# EAGLE design InkTime_Schematic (EAGLE 9.7.0)
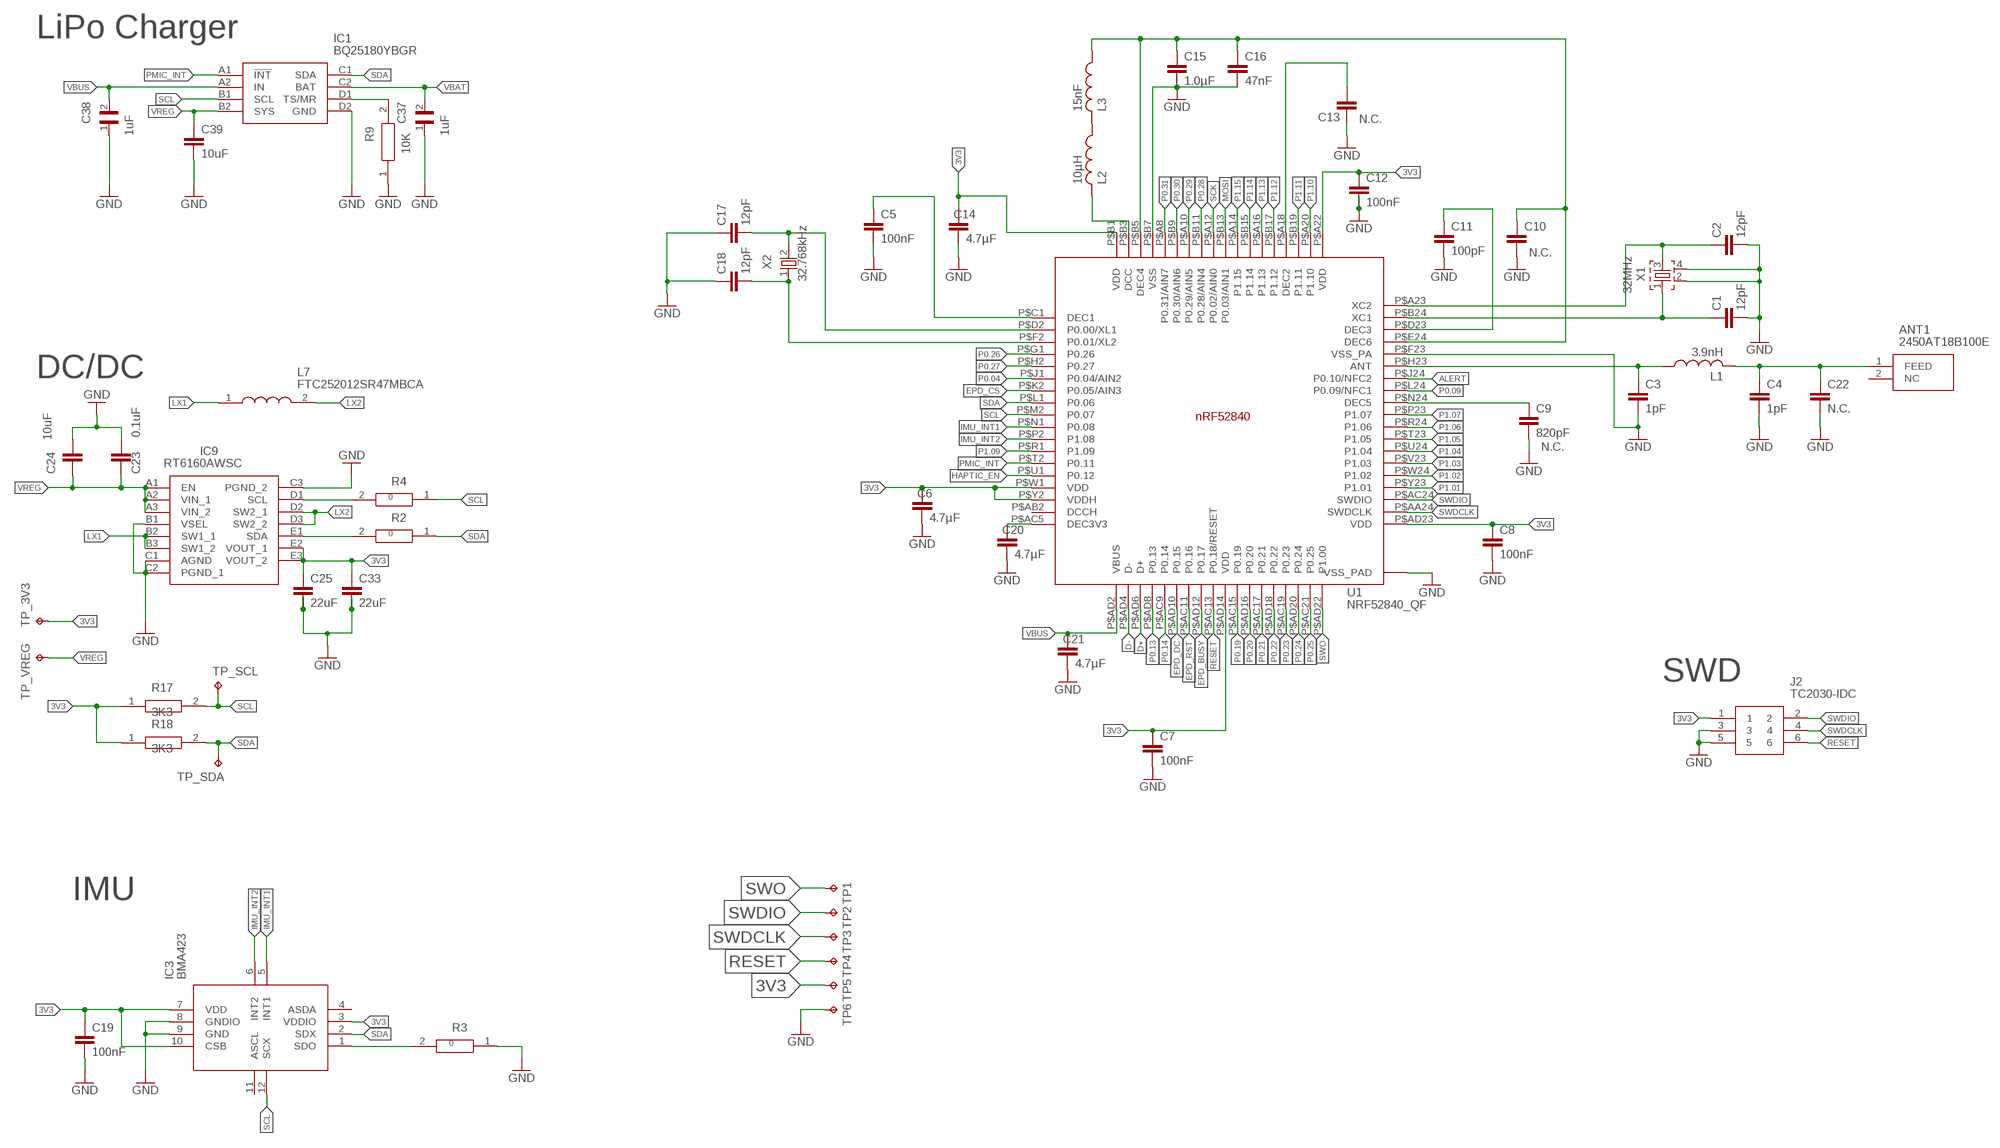
[diagram p0: schematic, sheet 1, part 1 of 2]
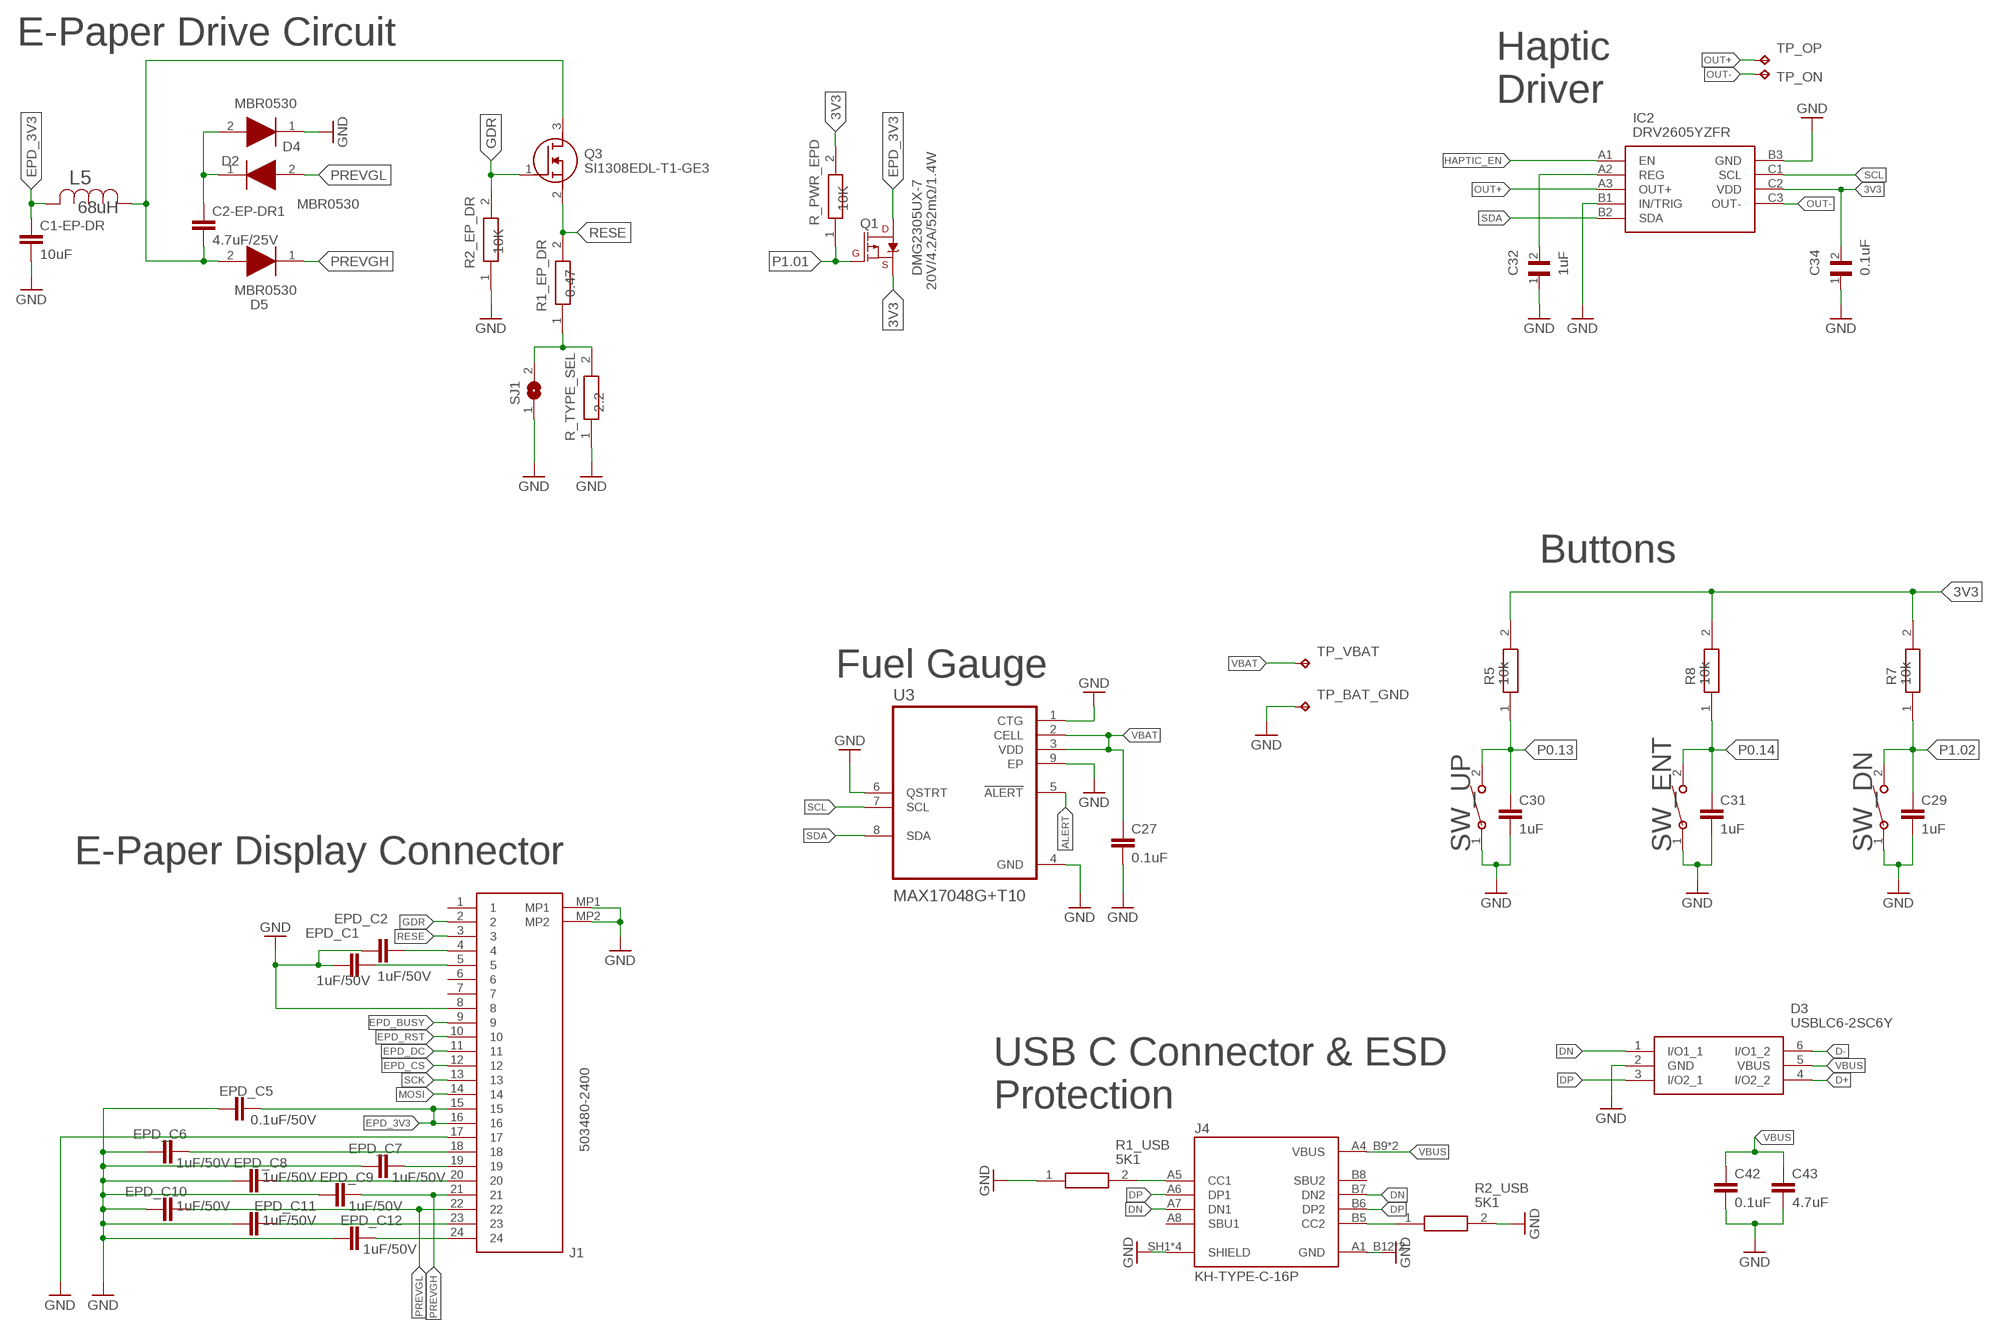
[diagram p1: schematic, sheet 1, part 2 of 2]

## Parts
ANT1  2450AT18B100E  2450AT18B100E_2450AT18B100E  [2450AT18B100E_ANTC3216X140N]
C1  12pF  NORDIC_NRF_3_CAPACITOR_0201_L  [NORDIC_NRF_3_RESC0201_L]
C1-EP-DR  10uF  NORDIC_NRF_3_CAPACITOR_0402_L  [NORDIC_NRF_3_RESC0402_L]
C2  12pF  NORDIC_NRF_3_CAPACITOR_0201_L  [NORDIC_NRF_3_RESC0201_L]
C2-EP-DR1  4.7uF/25V  NORDIC_NRF_3_CAPACITOR_0402_L  [NORDIC_NRF_3_RESC0402_L]
C3  1pF  NORDIC_NRF_3_CAPACITOR_0201_L  [NORDIC_NRF_3_RESC0201_L]
C4  1pF  NORDIC_NRF_3_CAPACITOR_0201_L  [NORDIC_NRF_3_RESC0201_L]
C5  100nF  NORDIC_NRF_3_CAPACITOR_0201_L  [NORDIC_NRF_3_RESC0201_L]
C6  4.7µF  NORDIC_NRF_3_CAPACITOR_0402_L  [NORDIC_NRF_3_RESC0402_L]
C7  100nF  NORDIC_NRF_3_CAPACITOR_0201_L  [NORDIC_NRF_3_RESC0201_L]
C8  100nF  NORDIC_NRF_3_CAPACITOR_0201_L  [NORDIC_NRF_3_RESC0201_L]
C9  820pF  NORDIC_NRF_3_CAPACITOR_0201_L  [NORDIC_NRF_3_RESC0201_L]
C10  NORDIC_NRF_3_CAPACITOR_0201_L  [NORDIC_NRF_3_RESC0201_L]
C11  100pF  NORDIC_NRF_3_CAPACITOR_0201_L  [NORDIC_NRF_3_RESC0201_L]
C12  100nF  NORDIC_NRF_3_CAPACITOR_0201_L  [NORDIC_NRF_3_RESC0201_L]
C13  NORDIC_NRF_3_CAPACITOR_0201_L  [NORDIC_NRF_3_RESC0201_L]
C14  4.7µF  NORDIC_NRF_3_CAPACITOR_0402_L  [NORDIC_NRF_3_RESC0402_L]
C15  1.0µF  NORDIC_NRF_3_CAPACITOR_0402_L  [NORDIC_NRF_3_RESC0402_L]
C16  47nF  NORDIC_NRF_3_CAPACITOR_0201_L  [NORDIC_NRF_3_RESC0201_L]
C17  12pF  NORDIC_NRF_3_CAPACITOR_0201_L  [NORDIC_NRF_3_RESC0201_L]
C18  12pF  NORDIC_NRF_3_CAPACITOR_0201_L  [NORDIC_NRF_3_RESC0201_L]
C19  100nF  NORDIC_NRF_3_CAPACITOR_0201_L  [NORDIC_NRF_3_RESC0201_L]
C20  4.7µF  NORDIC_NRF_3_CAPACITOR_0402_L  [NORDIC_NRF_3_RESC0402_L]
C21  4.7µF  NORDIC_NRF_3_CAPACITOR_0402_L  [NORDIC_NRF_3_RESC0402_L]
C22  N.C.  NORDIC_NRF_3_CAPACITOR_0201_L  [NORDIC_NRF_3_RESC0201_L]
C23  0.1uF  NORDIC_NRF_3_CAPACITOR_0201_L  [NORDIC_NRF_3_RESC0201_L]
C24  10uF  NORDIC_NRF_3_CAPACITOR_0402_L  [NORDIC_NRF_3_RESC0402_L]
C25  22uF  NORDIC_NRF_3_CAPACITOR_0402_L  [NORDIC_NRF_3_RESC0402_L]
C27  0.1uF  NORDIC_NRF_3_CAPACITOR_0201_L  [NORDIC_NRF_3_RESC0201_L]
C29  1uF  NORDIC_NRF_3_CAPACITOR_0402_L  [NORDIC_NRF_3_RESC0402_L]
C30  1uF  NORDIC_NRF_3_CAPACITOR_0402_L  [NORDIC_NRF_3_RESC0402_L]
C31  1uF  NORDIC_NRF_3_CAPACITOR_0402_L  [NORDIC_NRF_3_RESC0402_L]
C32  1uF  GRM011R60J152KE01L_2_GRM011R60J152KE01L  [GRM011R60J152KE01L_2_CAPC0201X13N]
C33  22uF  NORDIC_NRF_3_CAPACITOR_0402_L  [NORDIC_NRF_3_RESC0402_L]
C34  0.1uF  GRM011R60J152KE01L_2_GRM011R60J152KE01L  [GRM011R60J152KE01L_2_CAPC0201X13N]
C37  1uF  GRM011R60J152KE01L_2_GRM011R60J152KE01L  [GRM011R60J152KE01L_2_CAPC0201X13N]
C38  1uF  GRM011R60J152KE01L_2_GRM011R60J152KE01L  [GRM011R60J152KE01L_2_CAPC0201X13N]
C39  10uF  NORDIC_NRF_3_CAPACITOR_0402_L  [NORDIC_NRF_3_RESC0402_L]
C42  0.1uF  NORDIC_NRF_3_CAPACITOR_0201_L  [NORDIC_NRF_3_RESC0201_L]
C43  4.7uF  NORDIC_NRF_3_CAPACITOR_0402_L  [NORDIC_NRF_3_RESC0402_L]
D2  MBR0530  ESP32_C6_LIBRARY_5_MBR0530  [ESP32_C6_LIBRARY_5_SOD3716X135N]
D3  USBLC6-2SC6Y  ESP32_C6_LIBRARY_3_USBLC6-2SC6Y  [ESP32_C6_LIBRARY_3_SOT95P280X145-6N]
D4  MBR0530  ESP32_C6_LIBRARY_5_MBR0530  [ESP32_C6_LIBRARY_5_SOD3716X135N]
D5  MBR0530  ESP32_C6_LIBRARY_5_MBR0530  [ESP32_C6_LIBRARY_5_SOD3716X135N]
EPD_C1  1uF/50V  NORDIC_NRF_3_CAPACITOR_0402_L  [NORDIC_NRF_3_RESC0402_L]
EPD_C2  1uF/50V  NORDIC_NRF_3_CAPACITOR_0402_L  [NORDIC_NRF_3_RESC0402_L]
EPD_C5  0.1uF/50V  NORDIC_NRF_3_CAPACITOR_0201_L  [NORDIC_NRF_3_RESC0201_L]
EPD_C6  1uF/50V  NORDIC_NRF_3_CAPACITOR_0402_L  [NORDIC_NRF_3_RESC0402_L]
EPD_C7  1uF/50V  NORDIC_NRF_3_CAPACITOR_0402_L  [NORDIC_NRF_3_RESC0402_L]
EPD_C8  1uF/50V  NORDIC_NRF_3_CAPACITOR_0402_L  [NORDIC_NRF_3_RESC0402_L]
EPD_C9  1uF/50V  NORDIC_NRF_3_CAPACITOR_0402_L  [NORDIC_NRF_3_RESC0402_L]
EPD_C10  1uF/50V  NORDIC_NRF_3_CAPACITOR_0402_L  [NORDIC_NRF_3_RESC0402_L]
EPD_C11  1uF/50V  NORDIC_NRF_3_CAPACITOR_0402_L  [NORDIC_NRF_3_RESC0402_L]
EPD_C12  1uF/50V  NORDIC_NRF_3_CAPACITOR_0402_L  [NORDIC_NRF_3_RESC0402_L]
IC1  BQ25180YBGR  BQ25180YBGR_BQ25180YBGR  [BQ25180YBGR_BGA8C40P2X4_100X155X50]
IC2  DRV2605YZFR  DRV2605YZFR_DRV2605YZFR  [DRV2605YZFR_BGA9C50P3X3_144X144X62]
IC3  BMA423  BMA423_BMA423  [BMA423_BMA423]
IC9  RT6160AWSC  RT6160AWSC_RT6160AWSC  [RT6160AWSC_BGA15C40P3X5_140X230X60]
J1  503480-2400  503480-2400_503480-2400  [503480-2400_5034802400]
J2  TC2030-IDC  TC2030-IDC_TC2030-IDC  [TC2030-IDC_TC2030IDC]
J4  KH-TYPE-C-16P  KH-TYPE-C-16P_KH-TYPE-C-16P  [KH-TYPE-C-16P_KINGHELM_KH-TYPE-C-16P]
L1  3.9nH  NORDIC_NRF_2_INDUCTOR_0402_L  [NORDIC_NRF_2_RESC0402_L]
L2  10µH  NORDIC_NRF_2_INDUCTOR_0402_L  [NORDIC_NRF_2_RESC0402_L]
L3  15nF  NORDIC_NRF_2_INDUCTOR_0402_L  [NORDIC_NRF_2_RESC0402_L]
L5  68uH  ESP32_C6_LIBRARY_2_744043680IND_4828-WE-TPC_WRE  [ESP32_C6_LIBRARY_2_IND_4828-WE-TPC_WRE]
L7  FTC252012SR47MBCA  MLP2016SR47MT0S1_FTC252012SR47MBCA  [MLP2016SR47MT0S1_INDC2016X100N]
Q1  20V/4.2A/52mΩ/1.4W  ESP32_C6_LIBRARY_4_ESP32_WROVER_SPARKFUN-DISCRETESEMI_MOSFET_PCH-DMG2305UX-7  [ESP32_C6_LIBRARY_4_ESP32_C6_LIBRARY_4_ESP32_C6_LIBRARY_4_ESP32_C6_LIBRARY_4_ESP32_WROVER_SPARKFUN-DISCRETESEMI_SOT23-3]
Q3  SI1308EDL-T1-GE3  ESP32_C6_LIBRARY_6_SI1308EDL-T1-GE3  [ESP32_C6_LIBRARY_6_SOT65P210X110-3N]
R1_EP_DR  0.47  CPF0201D7K68C1_CPF0201D7K68C1  [CPF0201D7K68C1_0201]
R1_USB  5K1  ERA-1AEB3401C_CPF0201D7K68C1  [ERA-1AEB3401C_0201]
R2  CPF0201D7K68C1_CPF0201D7K68C1  [CPF0201D7K68C1_0201]
R2_EP_DR  10K  CPF0201D7K68C1_CPF0201D7K68C1  [CPF0201D7K68C1_0201]
R2_USB  5K1  ERA-1AEB3401C_CPF0201D7K68C1  [ERA-1AEB3401C_0201]
R3  CPF0201D7K68C1_CPF0201D7K68C1  [CPF0201D7K68C1_0201]
R4  CPF0201D7K68C1_CPF0201D7K68C1  [CPF0201D7K68C1_0201]
R5  10k  CPF0201D7K68C1_CPF0201D7K68C1  [CPF0201D7K68C1_0201]
R7  10k  CPF0201D7K68C1_CPF0201D7K68C1  [CPF0201D7K68C1_0201]
R8  10k  CPF0201D7K68C1_CPF0201D7K68C1  [CPF0201D7K68C1_0201]
R9  10K  CPF0201D7K68C1_CPF0201D7K68C1  [CPF0201D7K68C1_0201]
R17  3K3  CPF0201D7K68C1_CPF0201D7K68C1  [CPF0201D7K68C1_0201]
R18  3K3  CPF0201D7K68C1_CPF0201D7K68C1  [CPF0201D7K68C1_0201]
R_PWR_EPD  10K  CPF0201D7K68C1_CPF0201D7K68C1  [CPF0201D7K68C1_0201]
R_TYPE_SEL  2.2  CPF0201D7K68C1_CPF0201D7K68C1  [CPF0201D7K68C1_0201]
SJ1  ESP32_C6_LIBRARY_7_JUMPER_SJ  [ESP32_C6_LIBRARY_7_JUMPER_SJ]
SW_DN  2025-10-22_07-23-44_LIBRARY_EVP-AKE31ASW_EVP-AKE31A_PAN  [2025-10-22_07-23-44_LIBRARY_SW_EVP-AKE31A_PAN]
SW_ENT  SW_ENT  2025-10-22_07-23-44_LIBRARY_EVP-AKE31ASW_EVP-AKE31A_PAN  [2025-10-22_07-23-44_LIBRARY_SW_EVP-AKE31A_PAN]
SW_UP  2025-10-22_07-23-44_LIBRARY_EVP-AKE31ASW_EVP-AKE31A_PAN  [2025-10-22_07-23-44_LIBRARY_SW_EVP-AKE31A_PAN]
TP1  HECTOR_WATCH_1_TPTP20R  [HECTOR_WATCH_1_TP20R]
TP2  HECTOR_WATCH_1_TPTP20R  [HECTOR_WATCH_1_TP20R]
TP3  HECTOR_WATCH_1_TPTP20R  [HECTOR_WATCH_1_TP20R]
TP4  HECTOR_WATCH_1_TPTP20R  [HECTOR_WATCH_1_TP20R]
TP5  HECTOR_WATCH_1_TPTP20R  [HECTOR_WATCH_1_TP20R]
TP6  HECTOR_WATCH_1_TPTP20R  [HECTOR_WATCH_1_TP20R]
TP_3V3  HECTOR_WATCH_1_TPTP20R  [HECTOR_WATCH_1_TP20R]
TP_BAT_GND  HECTOR_WATCH_1_TPTP20R  [HECTOR_WATCH_1_TP20R]
TP_ON  HECTOR_WATCH_1_TPTP20R  [HECTOR_WATCH_1_TP20R]
TP_OP  HECTOR_WATCH_1_TPTP20R  [HECTOR_WATCH_1_TP20R]
TP_SCL  HECTOR_WATCH_1_TPTP20R  [HECTOR_WATCH_1_TP20R]
TP_SDA  HECTOR_WATCH_1_TPTP20R  [HECTOR_WATCH_1_TP20R]
TP_VBAT  HECTOR_WATCH_1_TPTP20R  [HECTOR_WATCH_1_TP20R]
TP_VREG  HECTOR_WATCH_1_TPTP20R  [HECTOR_WATCH_1_TP20R]
U1  NRF52840_QF  NORDIC_NRF_4_NRF52840_QF  [NORDIC_NRF_4_AQFN50P700X700X85_HS-74N]
U3  MAX17048G+T10  ESP32_C6_LIBRARY_MAX17048G+T10  [ESP32_C6_LIBRARY_SON50P200X200X80-9N]
X1  32MHz  NORDIC_NRF_XTAL_32MHZ  [NORDIC_NRF_BT-XTAL_2016_N]
X2  32.768kHz  NORDIC_NRF_1_XTAL_32KHZ  [NORDIC_NRF_1_XTAL_3215_N]

## Nets
3V3 [Power]: C6.1 C7.1 C8.1 C12.1 C14.1 C19.1 C25.1 C33.1 C34.2 IC2.C2(VDD) IC3.3(VDDIO) IC3.7(VDD) IC3.10(CSB) IC9.E2(VOUT_1) IC9.E3(VOUT_2) J2.1 Q1.2(S) R5.2 R7.2 R8.2 R17.1 R18.1 R_PWR_EPD.2 TP5.TP TP_3V3.TP U1.P$A22(VDD) U1.P$AD14(VDD) U1.P$AD23(VDD) U1.P$B1(VDD) U1.P$W1(VDD) U1.P$Y2(VDDH)
ALERT: U1.P$J24(P0.10/NFC2) U3.5(!ALERT)
D+: D3.4(I/O2_2) U1.P$AD6(D+)
D-: D3.6(I/O1_2) U1.P$AD4(D-)
DN: D3.1(I/O1_1) J4.A7(DN1) J4.B7(DN2)
DP: D3.3(I/O2_1) J4.A6(DP1) J4.B6(DP2)
EPD_3V3 [Power]: C1-EP-DR.1 EPD_C5.2 J1.15 J1.16 L5.2 Q1.3(D)
EPD_BUSY: J1.9 U1.P$AD12(P0.17)
EPD_CS: J1.12 U1.P$K2(P0.05/AIN3)
EPD_DC: J1.11 U1.P$AD10(P0.15)
EPD_RST: J1.10 U1.P$AC11(P0.16)
GDR [Power]: J1.2 Q3.1(G) R2_EP_DR.2
GND [Power]: C1-EP-DR.2 C1.2 C2.2 C3.2 C4.2 C5.2 C6.2 C7.2 C8.2 C9.2 C10.1 C11.2 C12.2 C13.1 C14.2 C15.2 C16.2 C17.1 C18.1 C19.2 C20.2 C21.2 C22.2 C23.1 C24.1 C25.2 C27.2 C29.2 C30.2 C31.2 C32.1 C33.2 C34.1 C37.1 C38.1 C39.2 C42.2 C43.2 D2.1(K) D3.2(GND) EPD_C1.1 EPD_C2.1 EPD_C5.1 EPD_C6.1 EPD_C7.1 EPD_C8.1 EPD_C9.1 EPD_C10.1 EPD_C11.1 EPD_C12.1 IC1.D2(GND) IC2.B1(IN/TRIG) IC2.B3(GND) IC3.8(GNDIO) IC3.9(GND) IC9.B1(VSEL) IC9.C1(AGND) IC9.C2(PGND_1) IC9.C3(PGND_2) J1.8 J1.17 J1.MP1 J1.MP2 J2.3 J2.5 J4.A1_B12(GND) J4.A12_B1(GND) J4.SH1(SHIELD) J4.SH2(SHIELD) J4.SH3(SHIELD) J4.SH4(SHIELD) R1_USB.1 R2_EP_DR.1 R2_USB.2 R3.1 R9.1 R_TYPE_SEL.1 SJ1.1 SW_DN.1 SW_ENT.1 SW_UP.1 TP6.TP TP_BAT_GND.TP U1.P$74(VSS_PAD) U1.P$75(VSS_PAD) U1.P$76(VSS_PAD) U1.P$77(VSS_PAD) U1.P$78(VSS_PAD) U1.P$79(VSS_PAD) U1.P$80(VSS_PAD) U1.P$81(VSS_PAD) U1.P$82(VSS_PAD) U1.P$83(VSS_PAD) U1.P$84(VSS_PAD) U1.P$85(VSS_PAD) U1.P$86(VSS_PAD) U1.P$87(VSS_PAD) U1.P$88(VSS_PAD) U1.P$89(VSS_PAD) U1.P$90(VSS_PAD) U1.P$B7(VSS) U1.P$F23(VSS_PA) U3.1(CTG) U3.4(GND) U3.6(QSTRT) U3.9(EP) X1.2 X1.4
HAPTIC_EN: IC2.A1(EN) U1.P$U1(P0.12)
IMU_INT1: IC3.5(INT1) U1.P$N1(P0.08)
IMU_INT2: IC3.6(INT2) U1.P$P2(P1.08)
LX1 [Power]: IC9.B2(SW1_1) IC9.B3(SW1_2) L7.1
LX2 [Power]: IC9.D2(SW2_1) IC9.D3(SW2_2) L7.2
MOSI: J1.14 U1.P$B13(P0.03/AIN1)
N$1: C5.1 U1.P$C1(DEC1)
N$2: C9.1 U1.P$N24(DEC5)
N$3: C11.1 U1.P$D23(DEC3)
N$4: IC9.D1(SCL) R4.2
N$5: C17.2 U1.P$D2(P0.00/XL1) X2.2
N$6: C18.2 U1.P$F2(P0.01/XL2) X2.1
N$7: C2-EP-DR1.2 D5.2(A) L5.1 Q3.3(D)
N$9: C3.1 L1.1 U1.P$H23(ANT)
N$10: ANT1.1(FEED) C4.1 C22.1 L1.2
N$12: C10.2 C15.1 C16.1 L3.1 U1.P$B5(DEC4) U1.P$E24(DEC6)
N$13: C2.1 U1.P$A23(XC2) X1.3
N$14: C1.1 U1.P$B24(XC1) X1.1
N$15: L2.1 L3.2
N$16: L2.2 U1.P$B3(DCC)
N$17: C13.2 U1.P$A18(DEC2)
N$18: IC3.1(SDO) R3.2
N$19: C20.1 U1.P$AC5(DEC3V3)
N$21: IC9.E1(SDA) R2.2
N$23: EPD_C8.2 J1.20
N$24: IC1.D1(TS/MR) R9.2
N$25: C2-EP-DR1.1 D2.2(A) D4.1(K)
N$27: EPD_C2.2 J1.4
N$29: R1_EP_DR.1 R_TYPE_SEL.2 SJ1.2
N$31: EPD_C1.2 J1.5
N$32: C32.2 IC2.A2(REG)
N$34: J4.B5(CC2) R2_USB.1
N$37: J4.A5(CC1) R1_USB.2
N$39: EPD_C7.2 J1.19
N$41: EPD_C6.2 J1.18
N$42: EPD_C11.2 J1.23
N$44: EPD_C12.2 J1.24
OUT+ [Power]: IC2.A3(OUT+) TP_OP.TP
OUT- [Power]: IC2.C3(OUT-) TP_ON.TP
P0.04: U1.P$J1(P0.04/AIN2)
P0.09: U1.P$L24(P0.09/NFC1)
P0.13: C30.1 R5.1 SW_UP.2 U1.P$AD8(P0.13)
P0.14: C31.1 R8.1 SW_ENT.2 U1.P$AC9(P0.14)
P0.19: U1.P$AC15(P0.19)
P0.20: U1.P$AD16(P0.20)
P0.21: U1.P$AC17(P0.21)
P0.22: U1.P$AD18(P0.22)
P0.23: U1.P$AC19(P0.23)
P0.24: U1.P$AD20(P0.24)
P0.25: U1.P$AC21(P0.25)
P0.26: U1.P$G1(P0.26)
P0.27: U1.P$H2(P0.27)
P0.28: U1.P$B11(P0.28/AIN4)
P0.29: U1.P$A10(P0.29/AIN5)
P0.30: U1.P$B9(P0.30/AIN6)
P0.31: U1.P$A8(P0.31/AIN7)
P1.01: Q1.1(G) R_PWR_EPD.1 U1.P$Y23(P1.01)
P1.02: C29.1 R7.1 SW_DN.2 U1.P$W24(P1.02)
P1.03: U1.P$V23(P1.03)
P1.04: U1.P$U24(P1.04)
P1.05: U1.P$T23(P1.05)
P1.06: U1.P$R24(P1.06)
P1.07: U1.P$P23(P1.07)
P1.09: U1.P$R1(P1.09)
P1.10: U1.P$A20(P1.10)
P1.11: U1.P$B19(P1.11)
P1.12: U1.P$B17(P1.12)
P1.13: U1.P$A16(P1.13)
P1.14: U1.P$B15(P1.14)
P1.15: U1.P$A14(P1.15)
PMIC_INT: IC1.A1(!INT) U1.P$T2(P0.11)
PREVGH [Power]: D5.1(K) EPD_C9.2 J1.21
PREVGL [Power]: D4.2(A) EPD_C10.2 J1.22
RESE [Power]: J1.3 Q3.2(S) R1_EP_DR.2
RESET: J2.6 TP4.TP U1.P$AC13(P0.18/RESET)
SCK: J1.13 U1.P$A12(P0.02/AIN0)
SCL: IC1.B1(SCL) IC2.C1(SCL) IC3.12(SCX) R4.1 R17.2 TP_SCL.TP U1.P$M2(P0.07) U3.7(SCL)
SDA: IC1.C1(SDA) IC2.B2(SDA) IC3.2(SDX) R2.1 R18.2 TP_SDA.TP U1.P$L1(P0.06) U3.8(SDA)
SWDCLK: J2.4 TP3.TP U1.P$AA24(SWDCLK)
SWDIO: J2.2 TP2.TP U1.P$AC24(SWDIO)
SWO: TP1.TP U1.P$AD22(P1.00)
VBAT [Power]: C27.1 C37.2 IC1.C2(BAT) TP_VBAT.TP U3.2(CELL) U3.3(VDD)
VBUS [Power]: C21.1 C38.2 C42.1 C43.1 D3.5(VBUS) IC1.A2(IN) J4.A4_B9(VBUS) J4.A9_B4(VBUS) U1.P$AD2(VBUS)
VREG [Power]: C23.2 C24.2 C39.1 IC1.B2(SYS) IC9.A1(EN) IC9.A2(VIN_1) IC9.A3(VIN_2) TP_VREG.TP
Unconnected: ANT1.2(NC) IC3.4(ASDA) IC3.11(ASCL) J1.1 J1.6 J1.7 J4.A8(SBU1) J4.B8(SBU2) U1.P$AB2(DCCH)

## Notes on the sheet
- LiPo Charger
- N.C.
- N.C.
- DC/DC
- N.C.
- 0
- 0
- SWD
- IMU
- 0
- E-Paper Drive Circuit
- Haptic
  Driver
- DMG2305UX-7
- Buttons
- Fuel Gauge
- E-Paper Display Connector
- USB C Connector & ESD
  Protection

## Library data of the parts
ANT1 = InkTime_v5:2450AT18B100E_2450AT18B100E: Antennas 2.45GHz ANTENNA Source: Datasheet <https://www.johansontechnology.com/datasheets/2450AT18B100/2450AT18B100.pdf>; ARROW_PART_NUMBER: 2450AT18B100E; ARROW_PRICE-STOCK: https://www.arrow.com/en/products/2450at18b100e/johanson-dielectrics?utm_currency=USD&region=nac; DESCRIPTION: Antennas 2.45GHz ANTENNA; HEIGHT: 1.4mm; MANUFACTURER_NAME: JOHANSON TECHNOLOGY; MANUFACTURER_PART_NUMBER: 2450AT18B100E; MOUSER_PART_NUMBER: 609-2450AT18B100E; MOUSER_PRICE-STOCK: https://www.mouser.co.uk/ProductDetail/Johanson-Technology/2450AT18B100E?qs=yCnrNFeXz%252Bh5MFsFIXGZGA%3D%3D
C1 C1-EP-DR C2 C2-EP-DR1 C3-C25 C27 C29-C31 C33 C39 C42 C43 EPD_C1 EPD_C2 EPD_C5-EPD_C12 = InkTime_v5:NORDIC_NRF_3_CAPACITOR: Generic chip capacitor
C32 C34 C37 C38 = InkTime_v5:GRM011R60J152KE01L_2_GRM011R60J152KE01L: Check availability <https://pricing.snapeda.com/parts/GRM011R60J152KE01L/Murata/view-part?ref=eda>; AVAILABILITY: In Stock; CHECK_PRICES: https://www.snapeda.com/parts/GRM011R60J152KE01L/Murata/view-part/?ref=eda; DESCRIPTION: SMD Capacitor X5R(EIA) with Capacitance: 1500pF Tol. 10%. Rated Voltage: 6.3Vdc; MF: Murata; MP: GRM011R60J152KE01L; PACKAGE: 0201 Murata; PRICE: None; SNAPEDA_LINK: https://www.snapeda.com/parts/GRM011R60J152KE01L/Murata/view-part/?ref=snap
D2 D4 D5 = InkTime_v5:ESP32_C6_LIBRARY_5_MBR0530: ON SEMICONDUCTOR - MBR0530 - DIODE, SCHOTTKY, 0.5A, 30V, SOD-123 Source: Datasheet <http://www.onsemi.com/pub/Collateral/MBR0530T1-D.PDF> Check availability <https://pricing.snapeda.com/parts/MBR0530/ON%20Semiconductor/view-part?ref=eda>; AVAILABILITY: In Stock; CHECK_PRICES: https://www.snapeda.com/parts/MBR0530/Onsemi/view-part/?ref=eda; DESCRIPTION: Diode Schottky 30 V 500mA Surface Mount SOD-123; MF: ON Semiconductor; MP: MBR0530; PACKAGE: SOD-123-2 ON Semiconductor; PRICE: None; PURCHASE-URL: https://www.snapeda.com/api/url_track_click_mouser/?unipart_id=179458&manufacturer=ON Semiconductor&part_name=MBR0530&search_term=None; SNAPEDA_LINK: https://www.snapeda.com/parts/MBR0530/Onsemi/view-part/?ref=snap
D3 = InkTime_v5:ESP32_C6_LIBRARY_3_USBLC6-2SC6Y: Low Cap. ESD Protection Auto SOT-23-6 STMicroelectronics USBLC6-2SC6Y, Dual Uni-Directional TVS Diode Array, 6-Pin SOT-23 Source: Datasheet <https://componentsearchengine.com/Datasheets/1/USBLC6-2SC6Y.pdf> Check availability <https://pricing.snapeda.com/parts/USBLC6-2SC6Y/STMicroelectronics/view-part?ref=eda>; AVAILABILITY: In Stock; CHECK_PRICES: https://www.snapeda.com/parts/USBLC6-2SC6Y/STMicroelectronics/view-part/?ref=eda; DESCRIPTION: 17V Clamp 5A (8/20µs) Ipp Tvs Diode Surface Mount SOT-23-6; MF: STMicroelectronics; MP: USBLC6-2SC6Y; PACKAGE: SOT-23-6 STMicroelectronics; PRICE: None; SNAPEDA_LINK: https://www.snapeda.com/parts/USBLC6-2SC6Y/STMicroelectronics/view-part/?ref=snap
IC1 = InkTime_v5:BQ25180YBGR_BQ25180YBGR: Charger IC Lithium Ion/Polymer, Lithium Iron Phosphate 8-DSBGA (1.6x1.1) Source: Datasheet <https://www.ti.com/lit/ds/symlink/bq25180.pdf?ts=1650264094470&ref_url=https%3A%2F%2Fwww.ti.com%2Fproduct%2FBQ25180>; ARROW_PART_NUMBER: BQ25180YBGR; ARROW_PRICE-STOCK: https://www.arrow.com/en/products/bq25180ybgr/texas-instruments?utm_currency=USD&region=nac; DESCRIPTION: Charger IC Lithium Ion/Polymer, Lithium Iron Phosphate 8-DSBGA (1.6x1.1); HEIGHT: 0.5mm; MANUFACTURER_NAME: Texas Instruments; MANUFACTURER_PART_NUMBER: BQ25180YBGR; MOUSER_PART_NUMBER: 595-BQ25180YBGR; MOUSER_PRICE-STOCK: https://www.mouser.co.uk/ProductDetail/Texas-Instruments/BQ25180YBGR?qs=doiCPypUmgEWjAK%252BJAX6Tw%3D%3D
IC2 = InkTime_v5:DRV2605YZFR_DRV2605YZFR: Haptic Driver for ERM/LRA with Built-In Library and Smart Loop Architecture Source: Datasheet <http://www.ti.com/lit/gpn/drv2605>; ARROW_PART_NUMBER: DRV2605YZFR; ARROW_PRICE-STOCK: https://www.arrow.com/en/products/drv2605yzfr/texas-instruments?region=nac; DESCRIPTION: Haptic Driver for ERM/LRA with Built-In Library and Smart Loop Architecture; HEIGHT: 0.625mm; MANUFACTURER_NAME: Texas Instruments; MANUFACTURER_PART_NUMBER: DRV2605YZFR
IC3 = InkTime_v5:BMA423_BMA423: Accelerometers Triaxial low-g 12bit Acceleration Sensor Source: Datasheet <https://www.mouser.com/datasheet/2/783/BST-BMA423-DS000-1509600.pdf>; ARROW_PART_NUMBER: BMA423; ARROW_PRICE-STOCK: https://www.arrow.com/en/products/bma423/bosch; DESCRIPTION: Accelerometers Triaxial low-g 12bit Acceleration Sensor; HEIGHT: 1mm; MANUFACTURER_NAME: BOSCH; MANUFACTURER_PART_NUMBER: BMA423; MOUSER_PART_NUMBER: 262-BMA423; MOUSER_PRICE-STOCK: https://www.mouser.co.uk/ProductDetail/Bosch-Sensortec/BMA423?qs=HXFqYaX1Q2xC%252BSgeGoX3mg%3D%3D
IC9 = InkTime_v5:RT6160AWSC_RT6160AWSC: Buck-Boost Regulator Positive Output Step-Up/Step-Down I2C DC-DC Controller IC 15-WL-CSP (BSC) (1.4x2.3) Source: Datasheet <https://www.richtek.com/SaveDownload.aspx?specid=RT6160A>; DESCRIPTION: Buck-Boost Regulator Positive Output Step-Up/Step-Down I2C DC-DC Controller IC 15-WL-CSP (BSC) (1.4x2.3); HEIGHT: 0.6mm; MANUFACTURER_NAME: RICHTEK; MANUFACTURER_PART_NUMBER: RT6160AWSC; MOUSER_PART_NUMBER: 835-RT6160AWSC; MOUSER_PRICE-STOCK: https://www.mouser.co.uk/ProductDetail/Richtek/RT6160AWSC?qs=amGC7iS6iy%2FLd9PSoixZXQ%3D%3D
J1 = InkTime_v5:503480-2400_503480-2400: FFC & FPC Connectors 0.5mm FPC RA SMT Dual Contact 24Ckt Source: Datasheet <https://componentsearchengine.com/Datasheets/1/503480-2400.pdf>; DESCRIPTION: FFC & FPC Connectors 0.5mm FPC RA SMT Dual Contact 24Ckt; HEIGHT: 1.87mm; MANUFACTURER_NAME: Molex; MANUFACTURER_PART_NUMBER: 503480-2400; MOUSER_PART_NUMBER: 538-503480-2400; MOUSER_PRICE-STOCK: https://www.mouser.co.uk/ProductDetail/Molex/503480-2400?qs=OAhjpuo3Vu7efIoxFh9AOw%3D%3D
J2 = InkTime_v5:TC2030-IDC_TC2030-IDC: CABLE ADAPTER 6 POS Source: Datasheet <https://datasheet.datasheetarchive.com/originals/distributors/Datasheets_SAMA/62bc384e093448baaaa63dbd0b9d8707.pdf>; DESCRIPTION: CABLE ADAPTER 6 POS; HEIGHT: 19mm; MANUFACTURER_NAME: Tag Connect; MANUFACTURER_PART_NUMBER: TC2030-IDC
J4 = InkTime_v5:KH-TYPE-C-16P_KH-TYPE-C-16P: Check availability <https://pricing.snapeda.com/parts/KH-TYPE-C-16P/kinghelm/view-part?ref=eda>; AVAILABILITY: Not in stock; CHECK_PRICES: https://www.snapeda.com/parts/KH-TYPE-C-16P/Kinghelm/view-part/?ref=eda; MF: kinghelm; MP: KH-TYPE-C-16P; PACKAGE: None; PRICE: None; SNAPEDA_LINK: https://www.snapeda.com/parts/KH-TYPE-C-16P/Kinghelm/view-part/?ref=snap
L1-L3 = InkTime_v5:NORDIC_NRF_2_INDUCTOR: Generic chip inductor
L5 = InkTime_v5:ESP32_C6_LIBRARY_2_744043680; COPYRIGHT: Copyright (C) 2024 Ultra Librarian. All rights reserved.; MANUFACTURER_PART_NUMBER: 744043680; MFR_NAME: Wurth Electronics
L7 = InkTime_v5:MLP2016SR47MT0S1_FTC252012SR47MBCA: SMD / SMT Inductors (Coils), L=0.47?H, L x W x T : Source: Datasheet <https://product.tdk.com/system/files/dam/doc/product/inductor/inductor/smd/catalog/inductor_commercial_power_mlp2016_en.pdf>; DESCRIPTION: SMD / SMT Inductors (Coils), L=0.47?H, L x W x T :; HEIGHT: 1mm; JLCPCB: https://jlcpcb.com/partdetail/6763488-FTC252012SR47MBCA/C5832368; MANUFACTURER_NAME: TDK; MANUFACTURER_PART_NUMBER: FTC252012SR47MBCA
Q1 = InkTime_v5:ESP32_C6_LIBRARY_4_ESP32_WROVER_SPARKFUN-DISCRETESEMI_MOSFET_PCH: P-channel MOSFETs Voltage controlled devices that allow control of high current outputs. SparkFun Products: SparkFun ESP32 Thing <https://www.sparkfun.com/products/13907> SparkFun ESP8266 Thing <https://www.sparkfun.com/products/13231> SparkFun Pi Servo HAT V2 <https://www.sparkfun.com/products/15316> DMG2305UX-7 (20V/4.2A/SOT23-3); PROD_ID: TRAN-14388
Q3 = InkTime_v5:ESP32_C6_LIBRARY_6_SI1308EDL-T1-GE3: MOSFET N-Ch 30V 1.5A TrenchFET SC70 Vishay Si1308EDL-T1-GE3 N-channel MOSFET Transistor, 1.5 A, 30 V, 3-Pin SC-70 Source: Datasheet <https://componentsearchengine.com/Datasheets/1/SI1308EDL-T1-GE3.pdf> Check availability <https://pricing.snapeda.com/parts/SI1308EDL-T1-GE3/Vishay%20Siliconix/view-part?ref=eda>; AVAILABILITY: In Stock; CHECK_PRICES: https://www.snapeda.com/parts/SI1308EDL-T1-GE3/Vishay+Siliconix/view-part/?ref=eda; DESCRIPTION: Si1308EDL-T1-GE3 N-channel MOSFET Transistor, 1.5 A, 30 V, 3-Pin SC-70 | Siliconix / Vishay SI1308EDL-T1-GE3; MF: Vishay Siliconix; MP: SI1308EDL-T1-GE3; PACKAGE: SOT-323 Vishay Semiconductor; PRICE: None; PURCHASE-URL: https://www.snapeda.com/api/url_track_click_mouser/?unipart_id=274603&manufacturer=Vishay Siliconix&part_name=SI1308EDL-T1-GE3&search_term=None; SNAPEDA_LINK: https://www.snapeda.com/parts/SI1308EDL-T1-GE3/Vishay+Siliconix/view-part/?ref=snap
R1_EP_DR R2 R2_EP_DR R3-R5 R7-R9 R17 R18 R_PWR_EPD R_TYPE_SEL = InkTime_v5:CPF0201D7K68C1_CPF0201D7K68C1: 7.68k 0201 Thin Film Surface Mount Fixed Resistor +/-0.5% 0.031W CPF0201D7K68C1 Source: Datasheet <http://www.te.com/commerce/DocumentDelivery/DDEController?Action=showdoc&DocId=Data Sheet1773200-1ApdfEnglishENG_DS_1773200-1_A.pdf4-2176215-6>
R1_USB R2_USB = InkTime_v5:ERA-1AEB3401C_CPF0201D7K68C1: 7.68k 0201 Thin Film Surface Mount Fixed Resistor +/-0.5% 0.031W CPF0201D7K68C1 Source: Datasheet <http://www.te.com/commerce/DocumentDelivery/DDEController?Action=showdoc&DocId=Data Sheet1773200-1ApdfEnglishENG_DS_1773200-1_A.pdf4-2176215-6>
SJ1 = InkTime_v5:ESP32_C6_LIBRARY_7_JUMPER_SJ: SMD solder JUMPER
SW_DN SW_ENT SW_UP = InkTime_v5:2025-10-22_07-23-44_LIBRARY_EVP-AKE31A; COPYRIGHT: Copyright (C) 2025 Ultra Librarian. All rights reserved.; DIGI-KEY_PART_NUMBER_1: P123437TR-ND; DIGI-KEY_PART_NUMBER_2: P123437CT-ND; DIGI-KEY_PART_NUMBER_3: P123437DKR-ND; MANUFACTURER_NAME: Panasonic; MANUFACTURER_PART_NUMBER: EVP-AKE31A
TP1-TP6 TP_3V3 TP_BAT_GND TP_ON TP_OP TP_SCL TP_SDA TP_VBAT TP_VREG = InkTime_v5:HECTOR_WATCH_1_TP: Test pad
U1 = InkTime_v5:NORDIC_NRF_4_NRF52840_QF: nRF52840 Features Advanced Single chip 2.4 GHz multi-protocol SoC 32-bit ARM Cortex-M4F Processor 1.7v to 5.5v operation 1MB flash + 256kB RAM Bluetooth 5 support for long range and high throughput 802.15.4 radio support On-chip NFC PPI –Programmable Peripheral Interconnect Automated power management system with automatic power management of each peripheral Configurable I/O mapping for analog and digital I/O 48 x GPIO 1 x QSPI 4 x Master/Slave SPI 2 x Two-wire interface (I²C) I²S interface 2 x UART 4 x PWM USB 2.0 controller ARM TrustZone CryptoCell-310 Cryptographic and security module AES 128-bit ECB/CCM/AAR hardware accelerator Digital microphone interface (PDM) Quadrature decoder 12-bit ADC Low power comparator On-chip 50Ω balun On-air compatible with nRF52, nRF51 and nRF24 Series Applications Advanced high performance wearables Wearables for secure payments Virtual Reality/Augmented Reality systems Smart Home sensor networks Smart city sensor networks High performance HID controllers Internet of Things (IoT) sensor networks Smart door locks Smart lighting networks Connected white goods
U3 = InkTime_v5:ESP32_C6_LIBRARY_MAX17048G+T10: Check availability <https://pricing.snapeda.com/parts/MAX17048G%2BT10/Analog%20Devices/view-part?ref=eda>; AVAILABILITY: In Stock; CHECK_PRICES: https://www.snapeda.com/parts/MAX17048G+T10/Analog+Devices/view-part/?ref=eda; DESCRIPTION: 3µA 1-Cell/2-Cell Fuel Gauge with ModelGauge; MF: Analog Devices; MP: MAX17048G+T10; PACKAGE: TDFN-8 Maxim; PRICE: None; PURCHASE-URL: https://www.snapeda.com/api/url_track_click_mouser/?unipart_id=329239&manufacturer=Analog Devices&part_name=MAX17048G+T10&search_term=None; SNAPEDA_LINK: https://www.snapeda.com/parts/MAX17048G+T10/Analog+Devices/view-part/?ref=snap
X1 = InkTime_v5:NORDIC_NRF_XTAL_32MHZ
X2 = InkTime_v5:NORDIC_NRF_1_XTAL_32KHZ

## Net classes
1 Power: width 0.3 mm

## Board
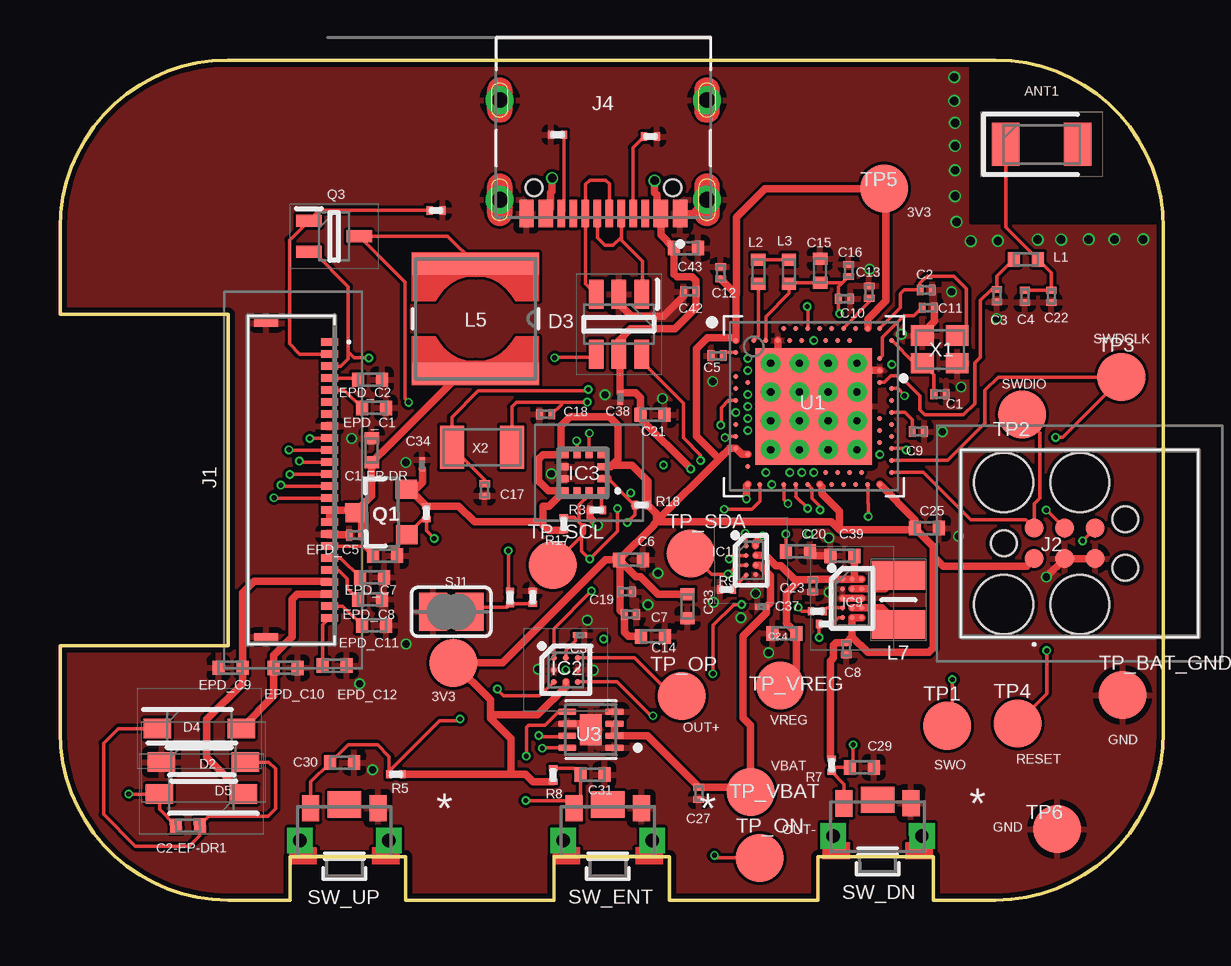
[diagram p2: board, top side]
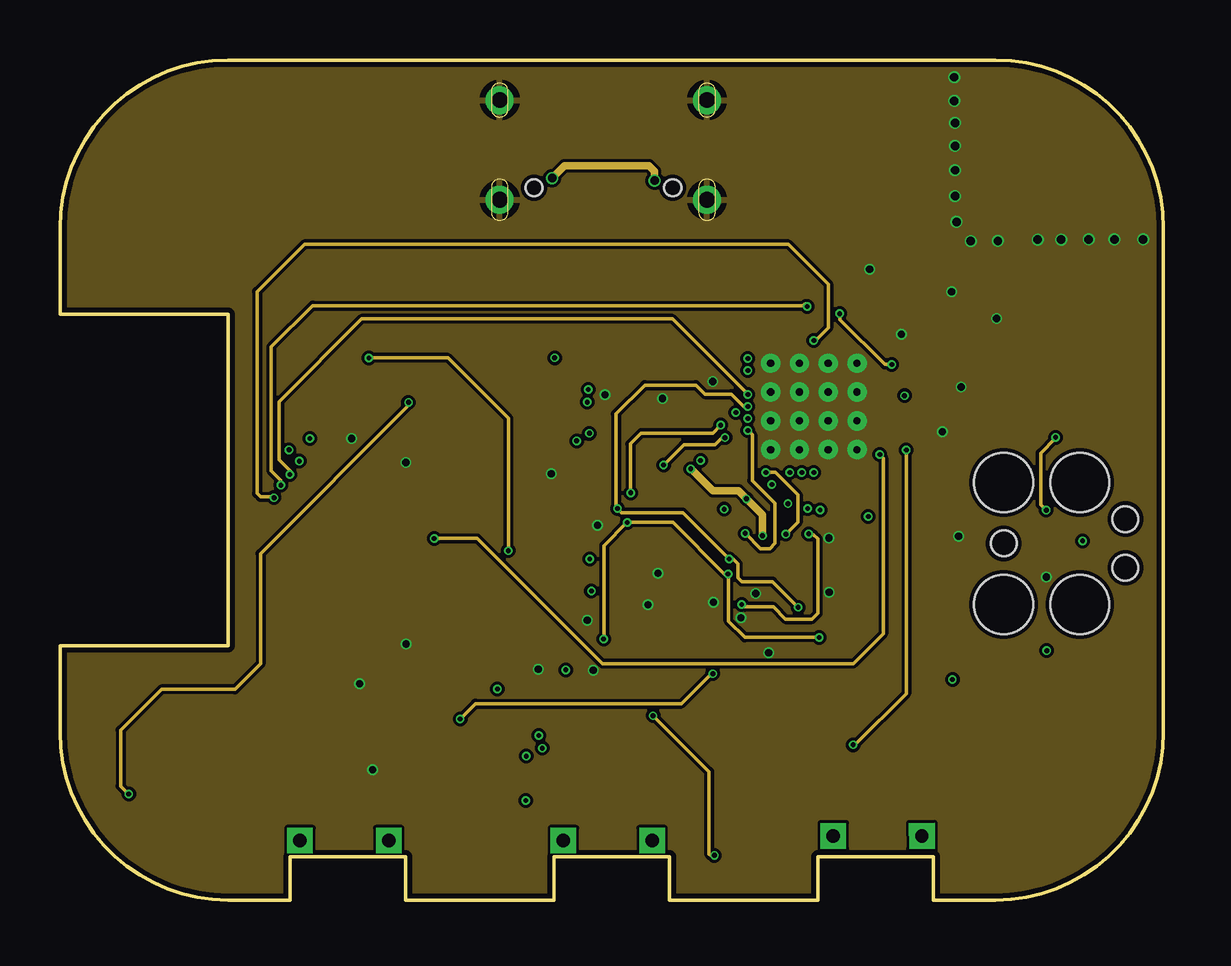
[diagram p3: board, inner layer Route2]
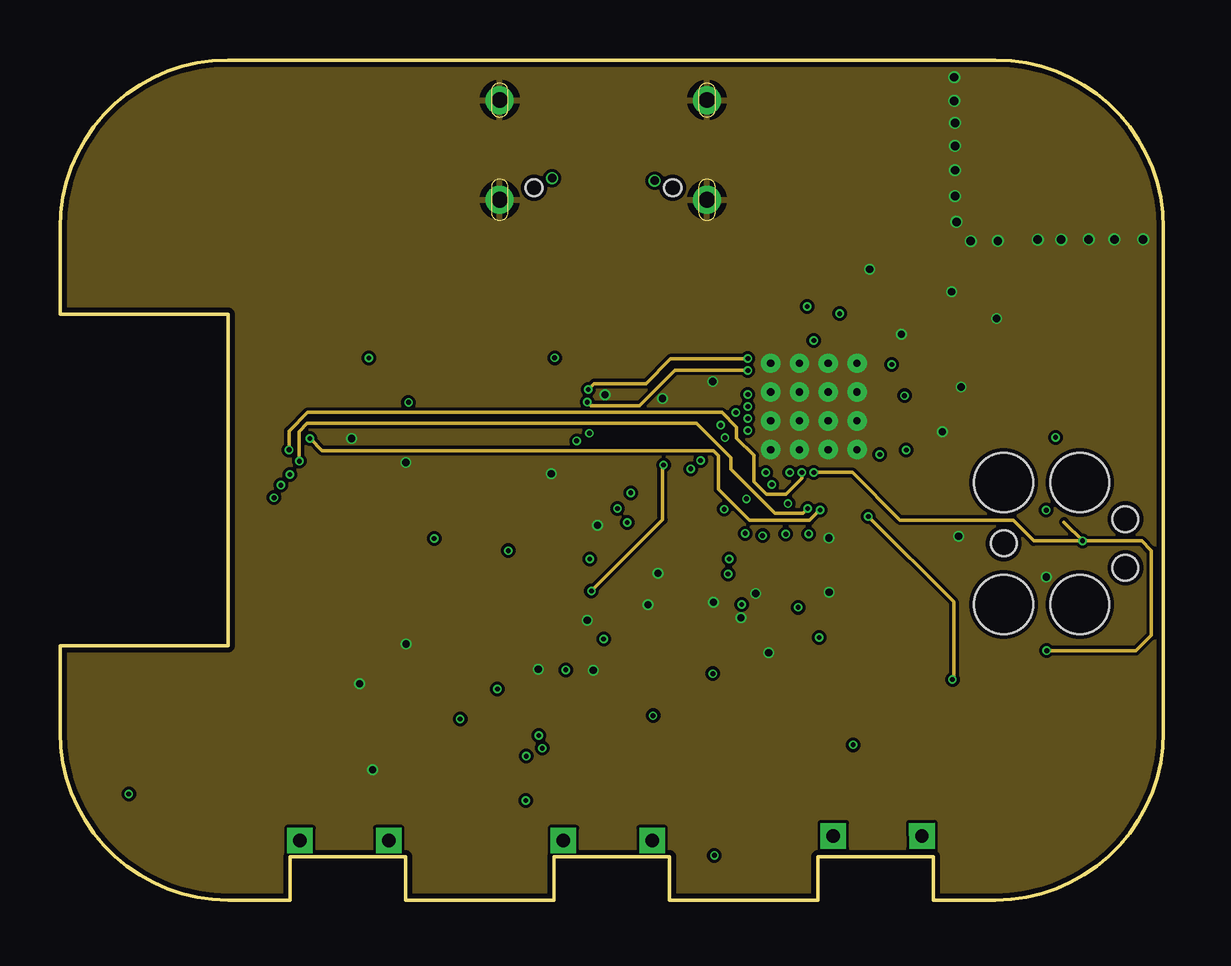
[diagram p4: board, inner layer Route15]
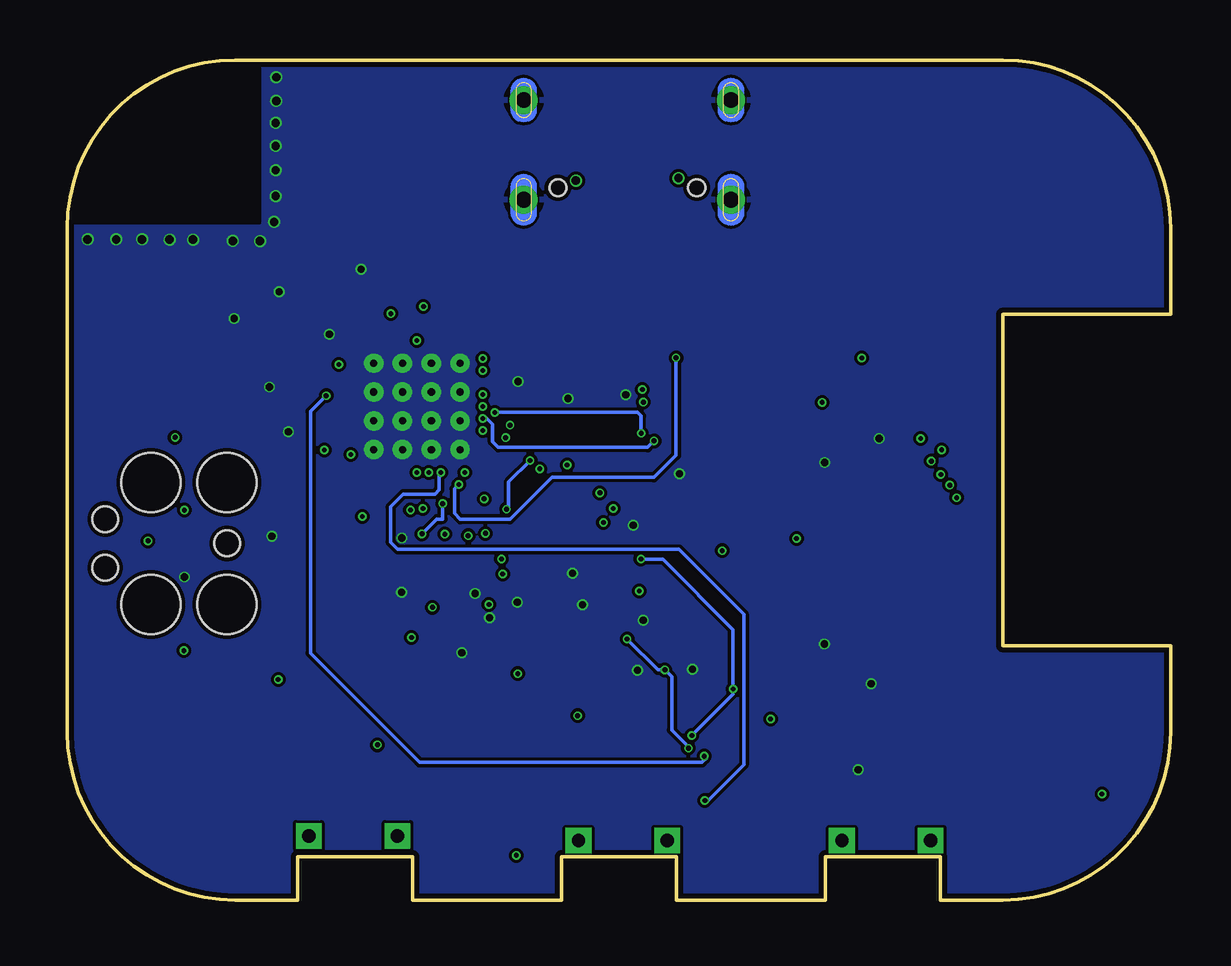
[diagram p5: board, bottom side, seen from below]

Size 46 x 35 mm. Coordinates in mm from the lower left corner, seen from the top.
Outline: 39,0 36.4,0 36.4,1.8 31.6,1.8 31.6,0 25.4,0 25.4,1.8 20.6,1.8 20.6,0 14.4,0 14.4,1.8 9.6,1.8 9.6,0 7,0 arc-90 0,7 0,10.6 7,10.6 7,24.4 0,24.4 0,28 arc-90 7,35 39,35 arc-90 46,28 46,7 arc-90 39,0
Copper layers (1+2*15+16): Top 0.035mm / dielectric 1.6mm / Route2 0.035mm / dielectric 0.15mm / Route15 0.035mm / dielectric 0.2mm / Bottom 0.035mm
Design rules "jlcpcb-2layers.dru *": minimum track width 0.15mm, minimum drill 0.2mm, track to track 5mil, track to pad 0.15mm, pad to pad 0.15mm, via to via 0.15mm, smd to smd 0.15mm, copper to edge 0.2mm, drill to drill 6mil, minimum pad ring 10mil, minimum via ring 0.075mm, stop-mask expansion 4mil, vias tented up to drill 0mil, thermal gap 10mil
tRestrict: area 38,28.2 to 45.7,34.7
bRestrict: area 38,28.2 to 46.1,35
vRestrict: area 38,28.2 to 45.7,34.7

### Footprints (pad centres in the part's own frame; a part is rotated, then mirrored left to right if it is on the bottom)
2450AT18B100E_ANTC3216X140N = smd 1.15 x 1.8: 1 -1.5,0; 2 1.5,0
NORDIC_NRF_3_RESC0201_L = smd 0.28 x 0.43: 1 -0.255,0; 2 0.255,0
NORDIC_NRF_3_RESC0402_L = smd 0.5 x 0.6: 1 -0.5,0; 2 0.5,0
GRM011R60J152KE01L_2_CAPC0201X13N = smd 0.22 x 0.23: 1 -0.185,0; 2 0.185,0
ESP32_C6_LIBRARY_5_SOD3716X135N = smd 1.15 x 0.8: 1 -1.75,0; 2 1.75,0
ESP32_C6_LIBRARY_3_SOT95P280X145-6N = smd 1.2 x 0.6: 1 -1.25,0.95; 2 -1.25,0; 3 -1.25,-0.95; 4 1.25,-0.95; 5 1.25,0; 6 1.25,0.95
BQ25180YBGR_BGA8C40P2X4_100X155X50 = smd 0.2 x 0.2: A1 -0.2,0.6; A2 0.2,0.6; B1 -0.2,0.2; B2 0.2,0.2; C1 -0.2,-0.2; C2 0.2,-0.2; D1 -0.2,-0.6; D2 0.2,-0.6
DRV2605YZFR_BGA9C50P3X3_144X144X62 = smd 0.25 x 0.25: A1 -0.5,0.5; A2 0,0.5; A3 0.5,0.5; B1 -0.5,0; B2 0,0; B3 0.5,0; C1 -0.5,-0.5; C2 0,-0.5; C3 0.5,-0.5
BMA423_BMA423 = smd 0.3 x 0.35: 1 -0.75,-0.775; 2 -0.25,-0.775; 3 0.25,-0.775; 4 0.75,-0.775; 7 0.75,0.775; 8 0.25,0.775; 9 -0.25,0.775; 10 -0.75,0.775 | smd 0.35 x 0.3: 5 0.775,-0.25; 6 0.775,0.25; 11 -0.775,0.25; 12 -0.775,-0.25
RT6160AWSC_BGA15C40P3X5_140X230X60 = smd 0.216 x 0.216: A1 -0.4,0.8; A2 0,0.8; A3 0.4,0.8; B1 -0.4,0.4; B2 0,0.4; B3 0.4,0.4; C1 -0.4,0; C2 0,0; C3 0.4,0; D1 -0.4,-0.4; D2 0,-0.4; D3 0.4,-0.4; E1 -0.4,-0.8; E2 0,-0.8; E3 0.4,-0.8
503480-2400_5034802400 = smd 0.3 x 0.7: 1 -5.75,1.525; 2 -5.25,1.525; 3 -4.75,1.525; 4 -4.25,1.525; 5 -3.75,1.525; 6 -3.25,1.525; 7 -2.75,1.525; 8 -2.25,1.525; 9 -1.75,1.525; 10 -1.25,1.525; 11 -0.75,1.525; 12 -0.25,1.525; 13 0.25,1.525; 14 0.75,1.525; 15 1.25,1.525; 16 1.75,1.525; 17 2.25,1.525; 18 2.75,1.525; 19 3.25,1.525; 20 3.75,1.525; 21 4.25,1.525; 22 4.75,1.525; 23 5.25,1.525; 24 5.75,1.525 | smd 0.3 x 1: MP1 -6.54,-1.125; MP2 6.54,-1.125
TC2030-IDC_TC2030IDC = smd 0.783 x 0.783: 1 -0.953,-0.635; 2 -0.953,0.635; 3 0.317,-0.635; 4 0.317,0.635; 5 1.588,-0.635; 6 1.588,0.635 | hole 2.451: -2.223,-2.54; -2.223,2.54; 0.952,-2.54; 0.952,2.54 | hole 1.067: -2.223,0; 2.857,-1.016; 2.857,1.016
KH-TYPE-C-16P_KINGHELM_KH-TYPE-C-16P = smd 0.6 x 1.15: A1_B12 -3.2,4.725; A4_B9 -2.4,4.725; A9_B4 2.4,4.725; A12_B1 3.2,4.725 | smd 0.3 x 1.15: A5 -1.25,4.725; A6 -0.25,4.725; A7 0.25,4.725; A8 1.25,4.725; B5 1.75,4.725; B6 0.75,4.725; B7 -0.75,4.725; B8 -1.75,4.725 | drill 0.65 pad 1.05: SH1 -4.32,0; SH2 4.32,0; SH3 -4.32,4.15; SH4 4.32,4.15 | hole 0.7: -2.89,3.65; 2.89,3.65
NORDIC_NRF_2_RESC0402_L = smd 0.5 x 0.6: 1 -0.5,0; 2 0.5,0
ESP32_C6_LIBRARY_2_IND_4828-WE-TPC_WRE = smd 0.9 x 5.3: 1 -2.286,0; 2 2.286,0
MLP2016SR47MT0S1_INDC2016X100N = smd 1.2 x 2.2: 1 -1.028,0; 2 1.028,0
ESP32_C6_LIBRARY_4_ESP32_C6_LIBRARY_4_ESP32_C6_LIBRARY_4_ESP32_C6_LIBRARY_4_ESP32_WROVER_SPARKFUN-DISCRETESEMI_SOT23-3 = smd 0.8 x 0.9: 1 -0.95,-1; 2 0.95,-1; 3 0,1.1
ESP32_C6_LIBRARY_6_SOT65P210X110-3N = smd 1.05 x 0.5: 1 -1.05,0.65; 2 -1.05,-0.65; 3 1.05,0
CPF0201D7K68C1_0201 = smd 0.35 x 0.25: 1 0,0.275; 2 0,-0.275
ERA-1AEB3401C_0201 = smd 0.35 x 0.25: 1 0,0.275; 2 0,-0.275
ESP32_C6_LIBRARY_7_JUMPER_SJ = smd 1.168 x 1.6: 1 -0.762,0; 2 0.762,0
2025-10-22_07-23-44_LIBRARY_SW_EVP-AKE31A_PAN = smd 0.711 x 1.092: 1 -1.4,-0.972; 2 1.4,-0.972 | drill 0.559 pad 0.914 square: 3 -1.848,0.381; 4 1.848,0.381 | smd 1.397 x 1.092: 5 0,-1.124
HECTOR_WATCH_1_TP20R = smd 2 x 2: TP 0,0
NORDIC_NRF_4_AQFN50P700X700X85_HS-74N = smd 4.85 x 4.85: P$74 0,0 | drill 0.3 pad 0.6: P$75 -1.8,1.8; P$76 -0.6,1.8; P$77 0.6,1.8; P$78 1.8,1.8; P$79 -1.8,0.6; P$80 -0.6,0.6; P$81 0.6,0.6; P$82 1.8,0.6; P$83 -1.8,-0.6; P$84 -0.6,-0.6; P$85 0.6,-0.6; P$86 1.8,-0.6; P$87 -1.8,-1.8; P$88 -0.6,-1.8; P$89 0.6,-1.8; P$90 1.8,-1.8 | smd 0.2 x 0.2: P$A8 -1.25,3.25; P$A10 -0.75,3.25; P$A12 -0.25,3.25; P$A14 0.25,3.25; P$A16 0.75,3.25; P$A18 1.25,3.25; P$A20 1.75,3.25; P$A22 2.25,3.25; P$A23 2.75,3.25; P$AA24 3.25,-2.25; P$AB2 -2.75,-2.5; P$AC5 -2,-2.75; P$AC9 -1,-2.75; P$AC11 -0.5,-2.75; P$AC13 0,-2.75; P$AC15 0.5,-2.75; P$AC17 1,-2.75; P$AC19 1.5,-2.75; P$AC21 2,-2.75; P$AC24 3.25,-2.75; P$AD2 -2.75,-3.25; P$AD4 -2.25,-3.25; P$AD6 -1.75,-3.25; P$AD8 -1.25,-3.25; P$AD10 -0.75,-3.25; P$AD12 -0.25,-3.25; P$AD14 0.25,-3.25; P$AD16 0.75,-3.25; P$AD18 1.25,-3.25; P$AD20 1.75,-3.25; P$AD22 2.25,-3.25; P$AD23 2.75,-3.25; P$B1 -3.25,2.75; P$B3 -2.5,2.75; P$B5 -2,2.75; P$B7 -1.5,2.75; P$B9 -1,2.75; P$B11 -0.5,2.75; P$B13 0,2.75; P$B15 0.5,2.75; P$B17 1,2.75; P$B19 1.5,2.75; P$B24 3.25,2.75; P$C1 -3.25,2.25; P$D2 -2.75,2; P$D23 2.75,2; P$E24 3.25,1.75; P$F2 -2.75,1.5; P$F23 2.75,1.5; P$G1 -3.25,1.25; P$H2 -2.75,1; P$H23 2.75,1; P$J1 -3.25,0.75; P$J24 3.25,0.75; P$K2 -2.75,0.5; P$L1 -3.25,0.25; P$L24 3.25,0.25; P$M2 -2.75,0; P$N1 -3.25,-0.25; P$N24 3.25,-0.25; P$P2 -2.75,-0.5; P$P23 2.75,-0.5; P$R1 -3.25,-0.75; P$R24 3.25,-0.75; P$T2 -2.75,-1; P$T23 2.75,-1; P$U1 -3.25,-1.25; P$U24 3.25,-1.25; P$V23 2.75,-1.5; P$W1 -3.25,-1.75; P$W24 3.25,-1.75; P$Y2 -2.75,-2; P$Y23 2.75,-2
ESP32_C6_LIBRARY_SON50P200X200X80-9N = smd 0.76 x 0.27: 1 -0.985,0.75; 2 -0.985,0.25; 3 -0.985,-0.25; 4 -0.985,-0.75; 5 0.985,-0.75; 6 0.985,-0.25; 7 0.985,0.25; 8 0.985,0.75 | smd 0.9 x 1.3: 9 0,0
NORDIC_NRF_BT-XTAL_2016_N = smd 0.95 x 0.85: 1 -0.725,-0.575; 2 0.725,-0.575; 3 0.725,0.575; 4 -0.725,0.575
NORDIC_NRF_1_XTAL_3215_N = smd 1 x 1.8: 1 -1.25,0; 2 1.25,0

### Placement (x,y rotation side)
ANT1  40.92,31.48 0 top
C1  36.68,21.08 0 top
C1-EP-DR  12.99,18.73 90 top
C2  36.1,25.42 0 top
C2-EP-DR1  5.33,3.1 180.3 top
C3  39.05,25.18 270 top
C4  40.22,25.15 270 top
C5  27.39,22.68 180 top
C6  23.81,14.17 0 top
C7  23.78,11.9 0 top
C8  32.78,10.47 270 top
C9  35.78,19.52 0 top
C10  32.7,25.05 180 top
C11  36.19,24.68 0 top
C12  27.54,26.13 90 top
C13  33.72,25.33 270 top
C14  24.72,10.98 0 top
C15  31.68,26.22 90 top
C16  32.87,26.23 90 top
C17  17.7,17.09 90 top
C18  20.24,20.24 0 top
C19  23.61,12.84 0 top
C20  30.76,14.53 0 top
C21  24.7,20.22 0 top
C22  41.33,25.16 270 top
C23  31.38,13.09 89.8 top
C24  30.19,11.11 0 top
C25  36.14,15.49 0 top
C27  26.63,4.45 270 top
C29  33.42,5.52 0 top
C30  11.76,5.73 0 top
C31  22.19,5.23 0 top
C32  21.68,11.04 180 top
C33  26.16,12.25 270 top
C34  15.1,18.15 270 top
C37  29.26,12.21 0 top
C38  23.35,20.93 90 top
C39  32.62,14.33 180 top
C42  26.25,25.35 180 top
C43  26.1,27.17 0 top
D2  5.98,5.75 0 top
D3  23.3,23.99 270 top
D4  5.81,7.15 0 top
D5  5.9,4.41 180 top
EPD_C1  13.09,20.5 180 top
EPD_C2  12.92,21.68 180 top
EPD_C5  12.32,15.21 0 top
EPD_C6  13.54,14.35 180 top
EPD_C7  13.01,13.44 180 top
EPD_C8  12.93,12.53 180 top
EPD_C9  7.11,9.68 0 top
EPD_C10  9.42,9.67 180 top
EPD_C11  13.09,11.44 180 top
EPD_C12  11.45,9.76 180 top
IC1  28.8,14.15 0.4 top
IC2  21.08,9.59 0 top
IC3  21.8,17.8 90 top
IC9  33.02,12.57 0 top
J1  9.72,17.5 270 top
J2  41.56,14.86 0 top
J4  22.65,33.33 180 top
L1  40.26,26.69 0 top
L2  29.11,26.18 270 top
L3  30.39,26.18 90 top
L5  17.32,24.22 270 top
L7  34.95,12.51 270 top
Q1  13.45,16.15 90.5 top
Q3  11.43,27.65 0 top
R1_EP_DR  18.76,12.6 180 top
R1_USB  24.62,31.81 270 top
R2  31.92,11.5 90 top
R2_EP_DR  15.67,28.73 270 top
R2_USB  20.74,31.88 270 top
R3  22.37,16.25 89.8 top
R4  31.57,12.03 90 top
R5  14,5.24 90 top
R7  32.17,5.61 180 top
R8  20.55,5.21 0 top
R9  27.78,12.94 90 top
R17  20.99,15.67 180 top
R18  24.23,16.45 270 top
R_PWR_EPD  15.28,16.14 180 top
R_TYPE_SEL  19.7,12.61 0 top
SJ1  16.31,12.01 0 top
SW_DN  34.08,3.05 180.1 top
SW_ENT  22.83,2.85 180 top
SW_UP  11.85,2.85 180 top
TP1  36.98,7.26 0 top
TP2  40.1,20.23 0 top
TP3  44.24,21.79 0 top
TP4  39.91,7.36 0 top
TP5  34.36,29.64 0 top
TP6  41.57,2.96 0 top
TP_3V3  16.4,9.88 0 top
TP_BAT_GND  44.3,8.54 0 top
TP_ON  29.18,1.75 0 top
TP_OP  25.92,8.49 0 top
TP_SCL  20.55,13.96 0 top
TP_SDA  26.29,14.44 0 top
TP_VBAT  28.78,4.5 0 top
TP_VREG  30.02,8.94 0 top
U1  31.42,20.57 0 top
U3  22.13,7.09 180 top
X1  36.67,22.94 0 top
X2  17.59,18.87 180 top

### Tracks (layer width: path | path; a pad name or v marks a point on that pad's centre or on a via)
3V3
  Top 0.305: U1.P$B1 28.17,23.43 | 28.17,23.43 28.17,25.22 28.18,25.23 | C12.1 28.18,25.23 | C34.2 15.11,17.4 14.82,17.11 Q1.2 14.58,17.11 R_PWR_EPD.2 16.62,16.42 17.29,15.75 20.14,15.75 | 23.02,18.12 23.25,18.36 23.25,19 23.26,19.01 23.26,19.79 22.91,20.14 21.27,20.14 20.89,19.77 20.89,18.68 IC3.7 20.13,18.55 19.95,18.36 19.95,17.47 20.37,17.05 IC3.10 20.39,16.42 20.14,16.42 20.14,15.75 | 23.02,18.12 22.94,18.05 IC3.3 | 20.14,15.75 20.14,15.62 20.36,15.4 R17.1 | C14.1 23.71,10.98 23.52,11.16 C7.1 23.35,12.07 C19.1 23.35,14.13 C6.1 | C33.1 24.93,12.75 24.2,13.48 24,13.48 C6.1 | C6.1 22.74,14.17 18.45,9.88 TP_3V3.TP 17.94,8.34 17.94,7.58 | C6.1 24.75,15.61 24.75,15.66 24.85,15.76 | U1.P$Y2 28.42,18.57 U1.P$W1 27.91,18.82 27.9,18.81 | 27.9,18.81 27.46,18.38 | 27.46,18.38 24.87,15.79 | 24.87,15.79 24.85,15.76 | 27.52,18.43 27.9,18.81 | 27.9,18.81 | 28.17,23.43 26.99,23.43 26.53,22.97 26.53,19.32 27.46,18.39 27.46,18.38 | R7.2 32.11,5.95 32.11,9.96 32.23,10.09 32.23,10.62 32.34,10.73 C8.1 33.02,10.97 | 33.02,10.97 IC9.E2 IC9.E3 | C25.1 36.42,14.71 36.42,14.32 | 36.42,14.32 36.42,10.51 36.23,10.32 33.67,10.32 33.02,10.97 | U1.P$AD23 35.64,15.85 C25.1 | U1.P$AD14 31.76,17.23 31.76,16.93 32.49,16.2 32.49,15.43 | C25.1 35.58,15.43 32.49,15.43 | 32.49,15.43 32.16,15.76 24.85,15.76 | U1.P$A22 33.67,24.2 34.44,24.97 34.44,29.56 TP5.TP 29.39,29.64 28.19,28.44 28.19,25.24 28.18,25.23 | J2.1 40.3,13.92 36.83,13.92 36.42,14.32 | R5.2 18.8,5.24 | 18.8,5.24 19.4,5.24 19.71,4.93 R8.2 | IC2.C2 21.08,8.88 19.91,7.71 18.07,7.71 17.94,7.58 | 18.8,6.72 18.8,5.24 | 24.87,15.79 24.87,16.09 R18.1 24.52,16.46 24.52,17.44 23.84,18.12 23.02,18.12
  Top 0.305: 17.94,7.58 18.8,6.72 | 18.8,6.72
ALERT  (via drill 0.2)
  Top 0.152: U1.P$J24 34.92,21.32 35.2,21.03 v35.2,21.01 | v19.44,5.99 19.44,7.21 19.52,7.29 20.22,7.29 20.77,7.84 U3.5
  Bottom 0.152: v35.2,21.01 35.86,20.36 35.86,10.28 31.31,5.74 19.54,5.74 19.36,5.91 v19.44,5.99
D+  (via drill 0.2)
  Top 0.152: D3.4 22.22,22.61 20.64,22.61 v20.62,22.59
  Bottom 0.152: v20.62,22.59 20.62,18.53 21.54,17.61 25.79,17.61 27.54,15.86 29.61,15.86 29.86,16.11 29.86,17.13 U1.P$AD6
  other vias: 29.67,17.32
D-  (via drill 0.2)
  Top 0.152: U1.P$AD4 29.17,16.64 29.19,16.62 28.84,16.28 v27.68,16.28 | D3.6 24.25,22.44 25.98,20.71 25.98,19.25 26.7,18.53 v26.7,18.31
  Bottom 0.152: v26.7,18.31 27.6,17.42 27.6,16.37 v27.68,16.28
DN
  Top 0.152: J4.A7 22.4,27.59 22.71,27.28 23.06,27.28 23.4,27.62 | J4.B7 23.4,27.62 | 23.4,27.62 23.4,27.48 24.27,26.6 24.27,25.27 D3.1
DP
  Top 0.152: D3.3 21.9,25.69 J4.B6 21.9,29.81 22.08,30 22.73,30 22.9,29.83 J4.A6
EPD_3V3
  Top 0.305: 12.32,16.17 12.24,16.25 J1.15 J1.16 | 12.32,16.17 Q1.3 12.57,15.92 EPD_C5.2 | 12.32,16.17 12.99,16.84 C1-EP-DR.1 13.71,18.95 16.69,21.93 L5.2
EPD_BUSY  (via drill 0.2)
  Top 0.152: J1.9 10.43,19.24 v10.42,19.23 | v31.68,16.25 31.68,16.4 31.35,16.73 31.35,17.14 U1.P$AD12
  Route15 0.152: v10.42,19.23 10.93,18.72 27.23,18.72 27.45,18.5 27.45,17.11 28.74,15.81 31.24,15.81 v31.68,16.25
EPD_CS  (via drill 0.2)
  Top 0.152: J1.12 9.6,17.75 v9.58,17.73
  Route2 0.152: U1.P$K2 25.53,24.21 12.58,24.21 9.13,20.76 9.13,18.35 9.58,17.89 v9.58,17.73
  other vias: 28.67,21.07
EPD_DC  (via drill 0.2)
  Top 0.152: J1.11 10.01,18.25 v9.98,18.28 | v31.17,16.32 30.67,16.81 U1.P$AD10
  Route15 0.152: v9.98,18.28 9.96,18.3 9.96,19.51 10.31,19.86 26.53,19.86 27.96,18.42 27.96,17.95 29.81,16.11 30.96,16.11 v31.17,16.32
EPD_RST  (via drill 0.2)
  Top 0.152: v9.55,18.75 J1.10
  Route15 0.152: v9.55,18.75 9.55,19.54 10.33,20.31 27.59,20.31 28.21,19.7 28.21,19.25 28.93,18.52 28.93,17.42 29.44,16.91 30.26,16.91 30.92,17.57 U1.P$AC11
  other vias: 30.92,17.82
GDR
  Top 0.152: R2_EP_DR.2 10.81,28.73 Q3.1 9.57,27.5 9.57,23.17 9.99,22.75 J1.2
GND  (via drill 0.3, 0.35)
  Top 0.305: J4.SH3 26.39,28.6 J4.A1_B12 | D3.2 23.3,24.85 23.82,24.32 25.16,24.32 26,25.16 C42.2 | J2.5 J2.3 v41.11,13.46 | U3.6 21.88,7.34 U3.9 | IC9.C3 IC9.C2 IC9.C1 | C39.2 31.46,14.33 C20.2 | U1.P$F23 33.52,22.07 U1.P$78 | EPD_C5.1 11.28,15.21 J1.17 | X1.4 35.95,23.61 36.45,24.11 C11.2 | U1.P$B7 29.92,22.67 U1.P$75 | v22.4,15.62 22.09,15.93 R3.1 | U1.P$74 U1.P$84
  other vias: 33.75,26.28 37.17,25.35 39.04,24.23 12.49,9.01 13.03,5.43 14.43,10.67 27.21,21.6 37.57,21.38 35.07,23.57 20.48,17.77 14.42,18.23 12.15,19.23 22.23,9.57 19.94,9.61 21.98,11.66 37.46,15.16 32.06,12.83 32.05,15.09 36.78,19.51 22.72,21.05 25.12,20.89 24.93,13.62 24.51,12.31 29,12.77 27.23,12.41 28.39,11.75 29.54,10.3 37.28,34.28 37.28,33.3 37.31,32.38 37.31,31.42 37.31,30.41 37.31,29.33 37.37,28.25 37.96,27.45 39.1,27.47 40.75,27.52 41.73,27.52 42.88,27.53 43.96,27.53 45.15,27.52
  pour Top: -1.4,-1 49.88,-1 49.88,36.63 -1.4,36.63
  pour Route2: -1.4,-1 49.88,-1 49.88,36.63 -1.4,36.63
  pour Route15: -1.4,-1 49.88,-1 49.88,36.63 -1.4,36.63
  pour Bottom: -1.4,-1 49.88,-1 49.88,36.63 -1.4,36.63
HAPTIC_EN  (via drill 0.2)
  Top 0.152: IC2.A1 20.58,11.3 v22.16,12.88 | v27.72,19.26 27.77,19.32 U1.P$U1
  Route2 0.152: v25.16,18.12 26,18.97 27.3,18.97 27.6,19.26 v27.72,19.26
  Route15 0.152: v22.16,12.88 25.11,15.84 25.11,18.12 v25.16,18.12
IMU_INT1  (via drill 0.2)
  Top 0.152: v22.07,19.45 22.05,19.43 IC3.5
  Bottom 0.152: U1.P$N1 22.22,20.32 22.07,20.17 v22.07,19.45
  other vias: 28.17,20.32
IMU_INT2  (via drill 0.2)
  Top 0.152: IC3.6 21.55,19.08 21.52,19.11 v21.54,19.13
  Bottom 0.152: v21.54,19.13 21.8,18.86 28.03,18.86 28.26,19.09 28.26,19.82 28.51,20.07 U1.P$P2
  other vias: 28.67,20.07
LX1
  Top 0.305: L7.1 34.38,12.97 IC9.B3 IC9.B2
LX2
  Top 0.305: IC9.D2 IC9.D3 34.27,12.17 L7.2
MOSI  (via drill 0.2)
  Top 0.152: v8.92,16.76 8.93,16.75 J1.14
  Route2 0.152: U1.P$B13 31.5,23.32 32.02,23.84 32.02,25.66 30.36,27.32 10.19,27.32 8.22,25.35 8.22,16.94 8.36,16.79 8.89,16.79 v8.92,16.76
  other vias: 31.42,23.32
N$1
  Top 0.152: U1.P$C1 27.78,22.82 C5.1
N$2
  Top 0.152: U1.P$N24 35.21,20.32 35.52,20 C9.1
N$3
  Top 0.152: U1.P$D23 34.27,22.67 34.27,23.45 35.17,24.34 35.6,24.34 C11.1
N$4
  Top 0.152: R4.2 31.98,12.17 IC9.D1
N$5  (via drill 0.2)
  Top 0.152: v22.02,21.27 21.96,21.21 17.42,21.21 16.34,20.12 X2.2 17.7,17.5 C17.2
  Route15 0.152: U1.P$D2 28.65,22.54 25.45,22.54 24.42,21.51 22.26,21.51 v22.02,21.27
  other vias: 28.67,22.57
N$6  (via drill 0.2)
  Top 0.152: v21.98,20.75 20.9,20.75 | 20.9,20.75 19.03,20.75 18.84,20.55 X2.1 | C18.2 20.9,20.64 20.9,20.75
  Route15 0.152: U1.P$F2 25.63,22.07 24.16,20.6 22.13,20.6 v21.98,20.75
  other vias: 28.67,22.07
N$7  (via drill 0.2)
  Top 0.152: L5.1 16.16,27.65 Q3.3 14.39,25.74 14.39,20.88 v14.53,20.74 | C2-EP-DR1.2 4.15,3.78 D5.2 v2.86,4.41
  Route2 0.152: v14.53,20.74 14.53,20.61 8.36,14.43 8.36,9.84 7.29,8.78 4.24,8.78 2.53,7.07 2.53,4.75 v2.86,4.41
N$9
  Top 0.152: L1.1 39.05,25.98 39.05,25.45 | 39.05,25.45 C3.1 | U1.P$H23 34.36,21.57 34.63,21.84 35,21.84 35.85,21 35.85,20.42 36.06,20.21 37.66,20.21 38.13,20.68 38.13,22.38 38.37,22.62 38.37,24.98 38.84,25.45 39.05,25.45
N$10
  Top 0.152: ANT1.1 39.42,28.03 L1.2 41.33,26.13 C22.1 C4.1
N$12  (via drill 0.2)
  Top 0.152: U1.P$B5 29.42,24.31 30.39,25.28 L3.1 30.42,25.72 C15.1 32.61,25.72 C16.1 32.44,25.55 C10.2 32.44,24.49 v32.5,24.43
  Route2 0.152: U1.P$E24 34.39,22.32 32.52,24.19 32.52,24.42 v32.5,24.43
  other vias: 34.67,22.32
N$13
  Top 0.152: U1.P$A23 35.03,24.67 35.03,25.26 35.19,25.42 C2.1 35.85,25.7 36.15,25.99 37.26,25.99 37.78,25.48 37.78,23.9 X1.3
N$14
  Top 0.152: C1.1 36.43,21.88 X1.1 35.62,22.36 U1.P$B24
N$15
  Top 0.152: L3.2 L2.1 | L2.1
N$16
  Top 0.152: L2.2 29.11,23.5 U1.P$B3
N$17
  Top 0.152: U1.P$A18 32.67,23.85 33.72,24.9 C13.2
N$18
  Top 0.152: R3.2 22.58,16.31 IC3.1
N$19  (via drill 0.2)
  Top 0.152: v30.26,15.24 C20.1
  Route2 0.152: U1.P$AC5 29.82,17.82 30.75,16.88 30.75,15.74 v30.26,15.24
  other vias: 29.42,17.82
N$21
  Top 0.152: R2.2 32.46,11.77 IC9.E1
N$23
  Top 0.152: J1.20 11.61,13.75 11.96,13.4 11.96,13 EPD_C8.2
N$24
  Top 0.152: R9.2 28.05,13 IC1.D1
N$25
  Top 0.152: D2.2 8.71,5.75 8.99,5.47 8.99,3.8 8.68,3.49 6.2,3.49 5.83,3.12 C2-EP-DR1.1 5.83,2.68 5.39,2.24 3.14,2.24 1.82,3.57 1.82,6.53 2.43,7.14 D4.1
N$27
  Top 0.152: J1.4 12.35,21.75 EPD_C2.2
N$29
  Top 0.152: SJ1.2 17.27,12.21 18.64,12.21 R1_EP_DR.1 R_TYPE_SEL.2
N$31
  Top 0.152: J1.5 11.84,21.25 EPD_C1.2
N$32
  Top 0.152: IC2.A2 21.08,10.4 21.49,10.81 C32.2
N$34
  Top 0.152: R2_USB.1 21.02,28.72 J4.B5
N$37
  Top 0.152: R1_USB.2 23.88,31.35 23.88,28.62 J4.A5
N$39
  Top 0.152: J1.19 11.7,14.25 EPD_C7.2
N$41
  Top 0.152: J1.18 12.64,14.75 EPD_C6.2
N$42
  Top 0.152: J1.23 11.79,12.25 EPD_C11.2
N$44
  Top 0.152: J1.24 10.95,11.46 EPD_C12.2
OUT+
  Top 0.152: IC2.A3 23.95,10.09 25.55,8.49 TP_OP.TP
OUT-  (via drill 0.2)
  Top 0.152: IC2.C3 23.23,9.09 24.64,7.68 v24.72,7.68 | v27.28,1.86 27.38,1.75 TP_ON.TP
  Route2 0.152: v24.72,7.68 27.05,5.35 27.05,1.91 27.11,1.86 v27.28,1.86
P0.13  (via drill 0.2)
  Top 0.152: SW_UP.2 10.45,4.92 C30.1 12,6.47 13.24,6.47 13.73,5.98 R5.1 13.73,5.36 15.83,7.46 16.6,7.46 v16.68,7.54 | U1.P$AD8 30.17,16.69 v30.34,16.51 | v16.68,7.54 | v27.21,9.43 27.21,11.44 28.08,12.31 v28.42,12.31
  Route2 0.152: v16.68,7.54 17.32,8.18 25.9,8.18 27.15,9.43 v27.21,9.43 | v28.42,12.31 28.52,12.21 29.75,12.21 30.25,11.71 31.34,11.71 31.58,11.95 31.58,15.05 31.41,15.23 31.21,15.23 v31.21,15.26
  Bottom 0.152: v31.21,15.26 30.59,15.87 30.34,15.87 v30.34,16.51
P0.14  (via drill 0.2)
  Top 0.152: R8.1 21.43,5.48 C31.1 21.69,4.08 SW_ENT.2 21.11,4.15 v19.42,4.15
  Bottom 0.152: 30.45,17.82 U1.P$AC9 30.49,17.75 30.49,17.09 30.67,16.91 31.99,16.91 32.52,16.38 32.52,14.92 32.22,14.61 20.49,14.61 17.79,11.91 17.79,5.63 19.25,4.17 19.42,4.17 v19.42,4.15
  other vias: 30.42,17.82
P1.01  (via drill 0.2)
  Top 0.152: Q1.1 15.11,15.87 R_PWR_EPD.1 15.28,15.39 v15.6,15.07
  Route2 0.152: U1.P$Y23 34.32,18.42 34.32,11.1 33.07,9.84 22.61,9.84 17.39,15.07 v15.6,15.07
  other vias: 34.17,18.57
P1.02  (via drill 0.2)
  Top 0.152: SW_DN.2 32.68,4.83 R7.1 32.36,5.52 C29.1 33.06,5.67 v33.06,6.47 | U1.P$W24 35.25,18.82 35.3,18.77 v35.28,18.75
  Route2 0.152: v35.28,18.75 35.28,8.6 33.14,6.47 v33.06,6.47
PMIC_INT  (via drill 0.2)
  Top 0.152: v28.56,15.28 28.6,15.24 IC1.A1
  Route2 0.152: U1.P$T2 28.86,19.38 28.86,17.47 29.81,16.52 29.81,14.87 29.59,14.64 29.2,14.64 v28.56,15.28 | v28.56,15.28
  other vias: 28.67,19.57
PREVGH
  Top 0.305: J1.21 11.2,13.29 8.09,13.29 7.61,12.8 EPD_C9.2 7.61,9.02 6.11,7.53 6.11,5.95 D5.1
PREVGL
  Top 0.305: J1.22 9.89,12.75 9.68,12.54 9.68,10.96 8.92,10.2 EPD_C10.2 8.92,8.51 D4.2
RESE  (via drill 0.2)
  Top 0.152: J1.3 11.7,22.25 12,22.55 12,22.85 | 12,22.85 12,25.56 10.56,27 Q3.2 | R1_EP_DR.2 18.69,12.95 v18.69,14.55 | v12.87,22.58 12.27,22.58 12,22.85
  Route2 0.152: v18.69,14.55 18.69,20.07 16.18,22.58 v12.87,22.58
RESET  (via drill 0.2)
  Top 0.152: v42.62,14.96 v42.62,14.97 J2.6 | v41.13,10.39 41.13,8.58 TP4.TP
  Route15 0.152: U1.P$AC13 33.03,17.82 35.02,15.82 39.73,15.82 40.59,14.96 v42.62,14.96 | 41.85,15.74 v42.62,14.96 | v42.62,14.96 45.09,14.96 45.49,14.56 45.49,11.03 44.85,10.39 v41.13,10.39
  other vias: 31.42,17.82
SCK  (via drill 0.2)
  Top 0.152: J1.13 9.24,17.25 v9.21,17.29 | 31.17,24.7 U1.P$A12
  Top 0.305: v31.14,24.73 31.17,24.7
  Route2 0.152: v9.21,17.29 9.21,17.5 8.81,17.89 8.81,23.04 10.54,24.77 31.1,24.77
  Route2 0.305: 31.1,24.77 v31.14,24.73
SCL  (via drill 0.2)
  Top 0.152: R4.1 30.93,12.03 v30.77,12.2 | v27.89,14.21 28.03,14.35 IC1.B1 | 21.64,15.75 21.64,16.46 22.05,16.87 IC3.12 | 21.75,15.64 21.75,14.54 v22.08,14.2 23.24,15.36 v23.24,16.31 | 21.75,15.64 21.87,15.64 21.87,15.29 TP_SCL.TP | 21.75,15.64 21.64,15.75 | R17.2 21.44,15.95 21.64,15.75 | IC2.C1 20,8.5 18.48,8.5 18.24,8.75 v18.24,8.79 | U3.7 21.11,6.81 20.01,6.81 v19.96,6.86
  Route2 0.152: v30.77,12.2 29.7,13.27 28.42,13.27 28.25,13.43 28.25,14.01 28.05,14.21 v27.89,14.21 25.96,16.14 23.41,16.14 v23.24,16.31 23.17,16.38 23.17,20.25 24.38,21.46 26.51,21.46 26.88,21.08 27.98,21.08 28.5,20.57 U1.P$M2
  Bottom 0.152: v22.08,14.2 21.17,14.2 18.24,11.27 v18.24,8.79 18.24,8.58 v19.96,6.86
  other vias: 28.67,20.57
SDA  (via drill 0.2)
  Top 0.152: R2.1 v31.64,10.94 v31.65,10.94 | IC1.C1 28.22,13.95 v27.85,13.58 27.15,13.58 TP_SDA.TP | R18.2 23.96,16.05 v23.64,15.73 | R18.2 23.64,16.77 | 23.64,16.77 22.84,17.56 | v23.79,16.97 23.64,16.82 23.64,16.77 | v20.1,6.32 20.12,6.34 U3.8 | v27.54,19.79 27.58,19.82 27.58,20.52 27.87,20.82 U1.P$L1
  Top 0.305: 22.84,17.56 22.59,17.56 IC3.2 | R18.2
  Route2 0.152: v31.65,10.94 28.55,10.94 27.87,11.62 27.87,13.58 v27.85,13.58 27.7,13.58 25.55,15.73 v23.64,15.73 | v23.64,15.73 | v27.54,19.79 27.21,19.45 24.22,19.45 23.77,19.01 23.77,17.11 23.85,17.03 v23.79,16.97 | v23.64,15.73 22.68,14.77 22.68,10.89 v22.66,10.87
  Bottom 0.152: v20.1,6.32 20.1,6.39 20.79,7.08 20.79,9.3 IC2.B2 21.38,9.59 v22.66,10.87
  other vias: 21.08,9.59
SWDCLK  (via drill 0.2)
  Top 0.152: 44.65,21.75 44.28,21.75 | 44.28,21.75 TP3.TP 39.11,21.79 38.56,21.24 38.56,19.87 37.01,18.32 U1.P$AA24 | J2.4 41.19,16.17 41.19,16.24 v41.11,16.24 | v41.5,19.28 41.8,19.28 44.28,21.75
  Route2 0.152: v41.11,16.24 40.88,16.48 40.88,18.62 41.5,19.24 v41.5,19.28
SWDIO
  Top 0.152: TP2.TP 40.85,19.48 40.85,16.75 40.61,16.5 J2.2 40.25,15.84 37.97,15.84 35.99,17.82 U1.P$AC24
SWO  (via drill 0.2)
  Top 0.152: U1.P$AD22 33.67,16.53 33.69,16.51 v33.69,15.98 | v37.2,9.19 37.2,7.47 TP1.TP
  Route15 0.152: v33.69,15.98 37.25,12.42 37.25,9.24 v37.2,9.19
VBAT
  Top 0.305: IC1.C2 29.17,13.95 29.61,13.52 29.61,12.38 C37.2 29.44,11.96 28.48,11 28.48,7.59 28.78,7.28 TP_VBAT.TP 28.58,4.7 C27.1 24.49,6.84 U3.2 U3.3
VBUS  (via drill 0.2, 0.35)
  Top 0.305: v26.3,17.96 24.2,20.06 C21.1 24.2,20.93 24,21.14 23.37,21.14 C38.2 23.35,22.69 D3.5 23.3,23.31 23.78,23.8 25.63,23.8 26.51,24.67 C42.1 26.51,25.8 26.34,25.96 25.71,25.96 25.6,26.08 C43.1 25.05,27.72 J4.A4_B9 25.05,28.96 24.88,29.13 24.88,29.38 24.79,29.47 v24.79,29.97 | v28.61,16.71 28.61,17.26 U1.P$AD2 | IC1.A2 29,14.89 v29.28,15.18 | v20.52,30.08 20.52,29.54 20.44,29.46 20.44,28.79 J4.A9_B4
  Route2 0.305: v20.52,30.08 21.04,30.6 24.55,30.6 24.79,30.36 v24.79,29.97 | v26.3,17.96 27.21,17.05 28.28,17.05 v28.61,16.71 29.28,16.05 v29.28,15.18
VREG
  Top 0.305: C39.1 33.12,13.47 IC9.A2 | IC9.A3 IC9.A2 | IC9.A2 IC9.A1 31.41,13.37 C23.2 30.85,13.34 | IC1.B2 29.41,14.35 29.85,13.92 30.06,13.92 30.64,13.34 30.85,13.34 | TP_VREG.TP 30.69,9.61 C24.2 30.28,11.52 30.28,12.77 30.85,13.34

### Text on the board
tPlace: 3V3 | SWDCLK | SWDIO | 3V3 | VREG | OUT+ | GND | VBAT | SWO | RESET | OUT- | GND